# EAGLE board retrostoneA20-1.15 (EAGLE 7.6.0), part 1 of 5
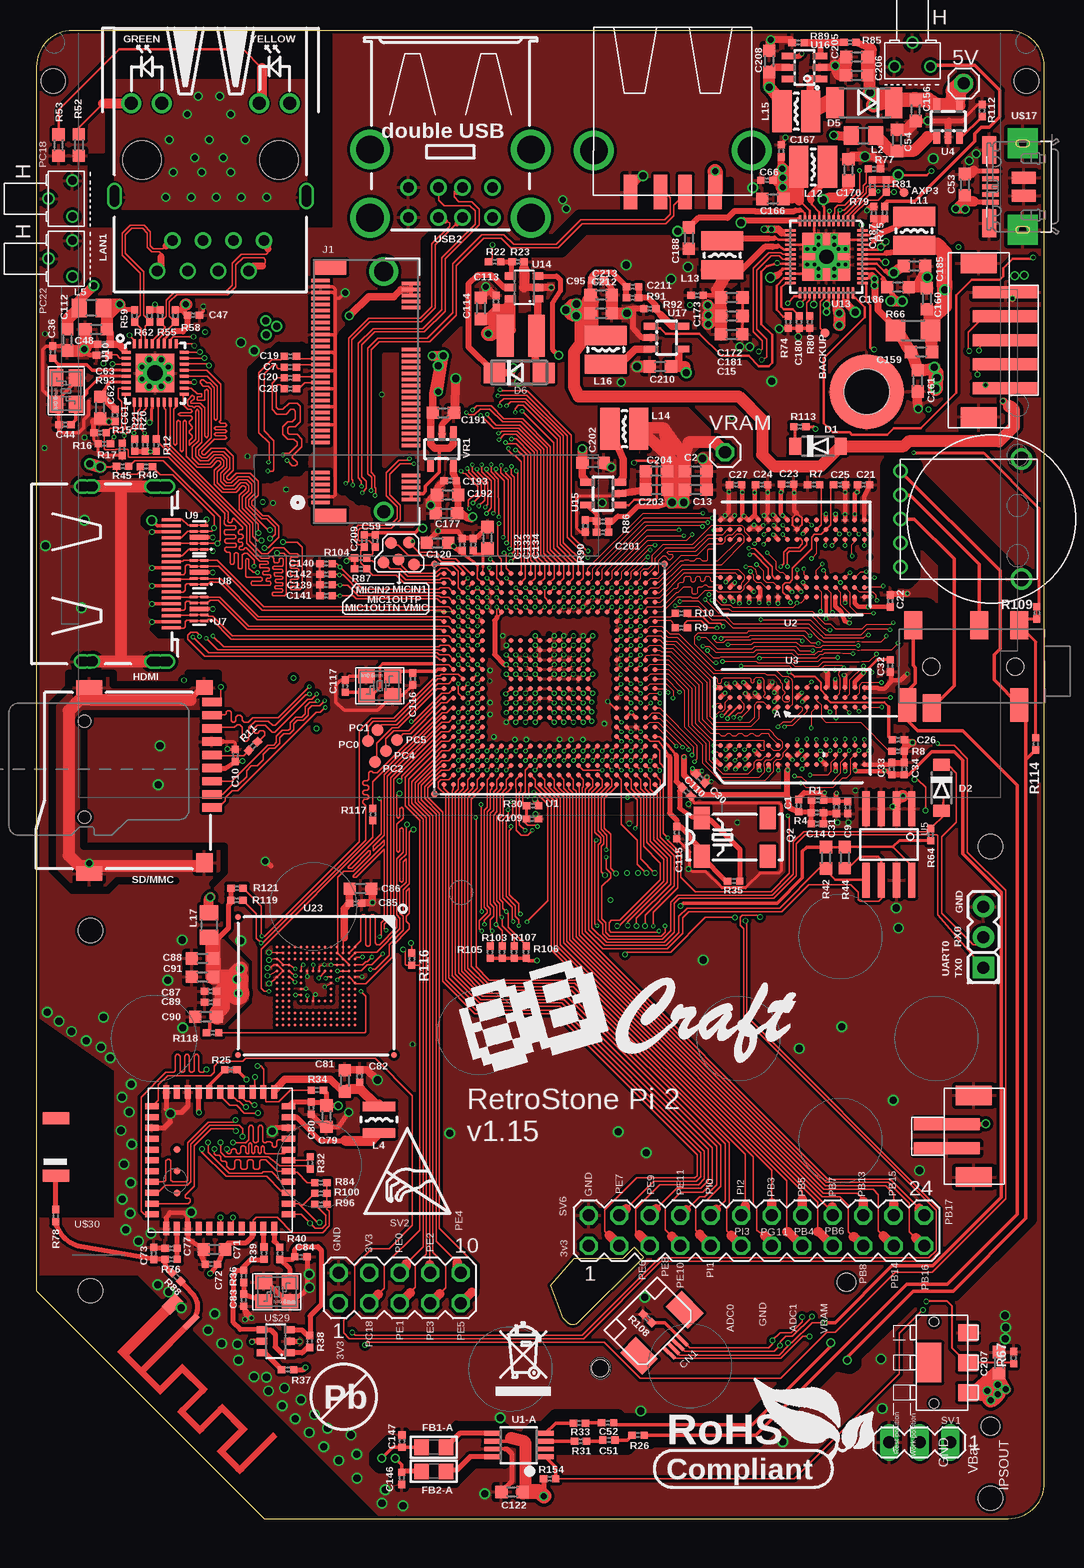
[diagram p5: board, top side]
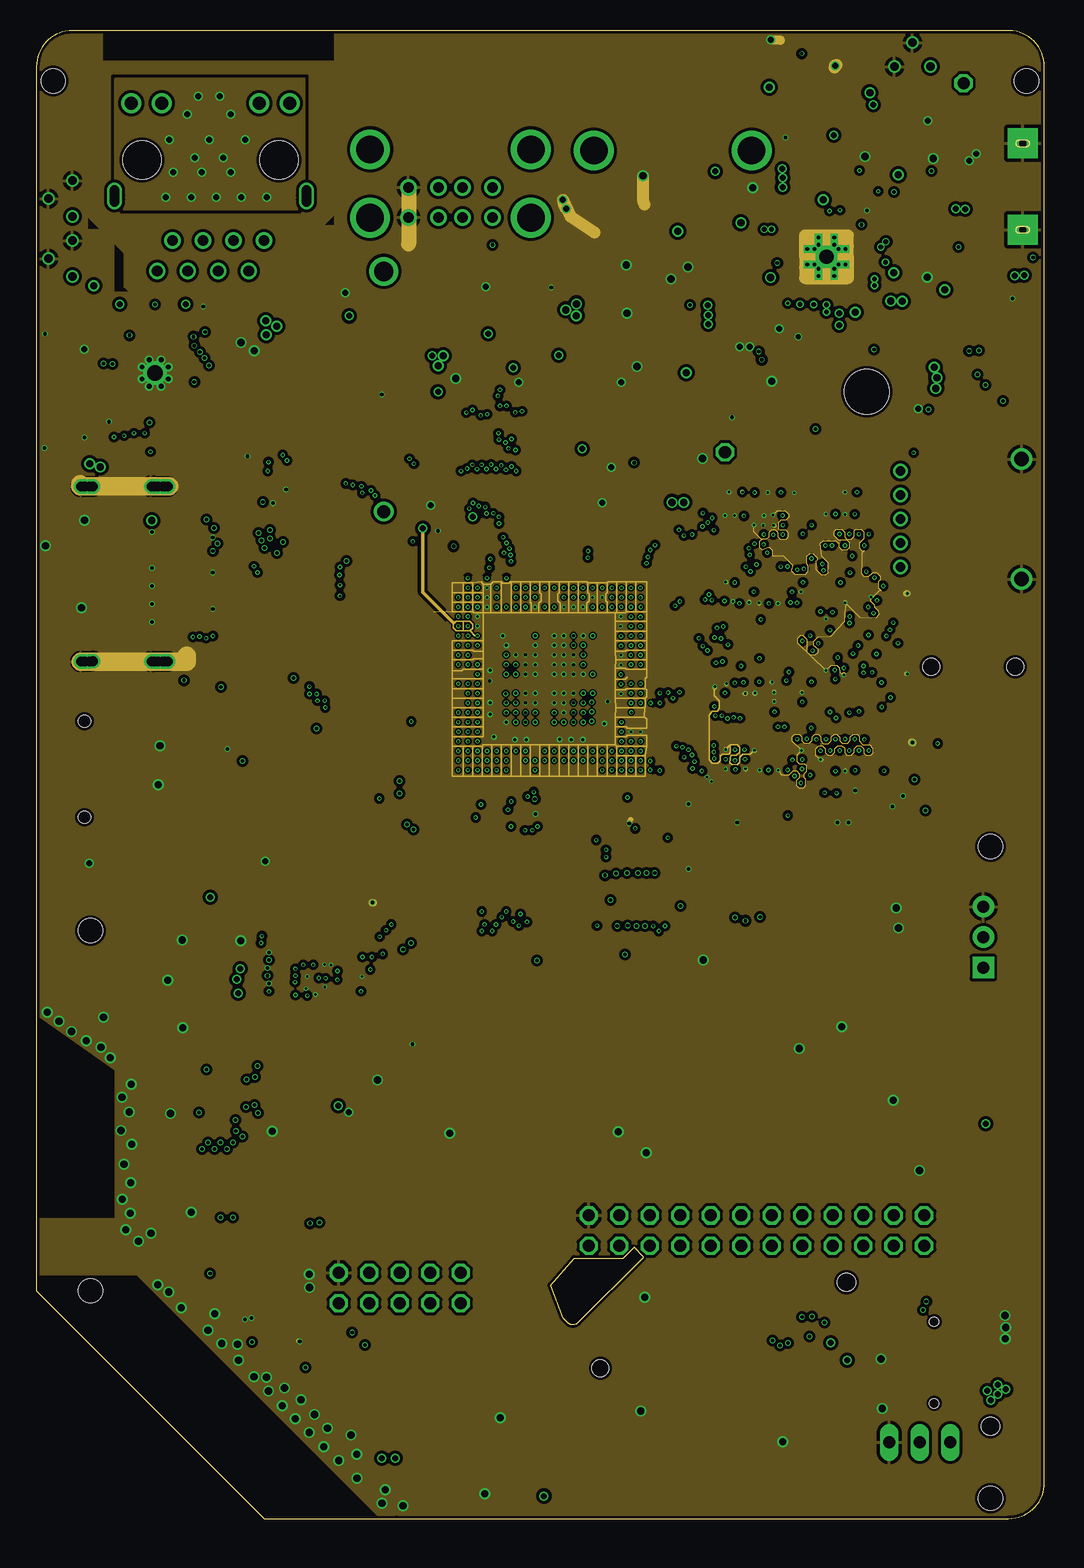
[diagram p6: board, inner layer GND]
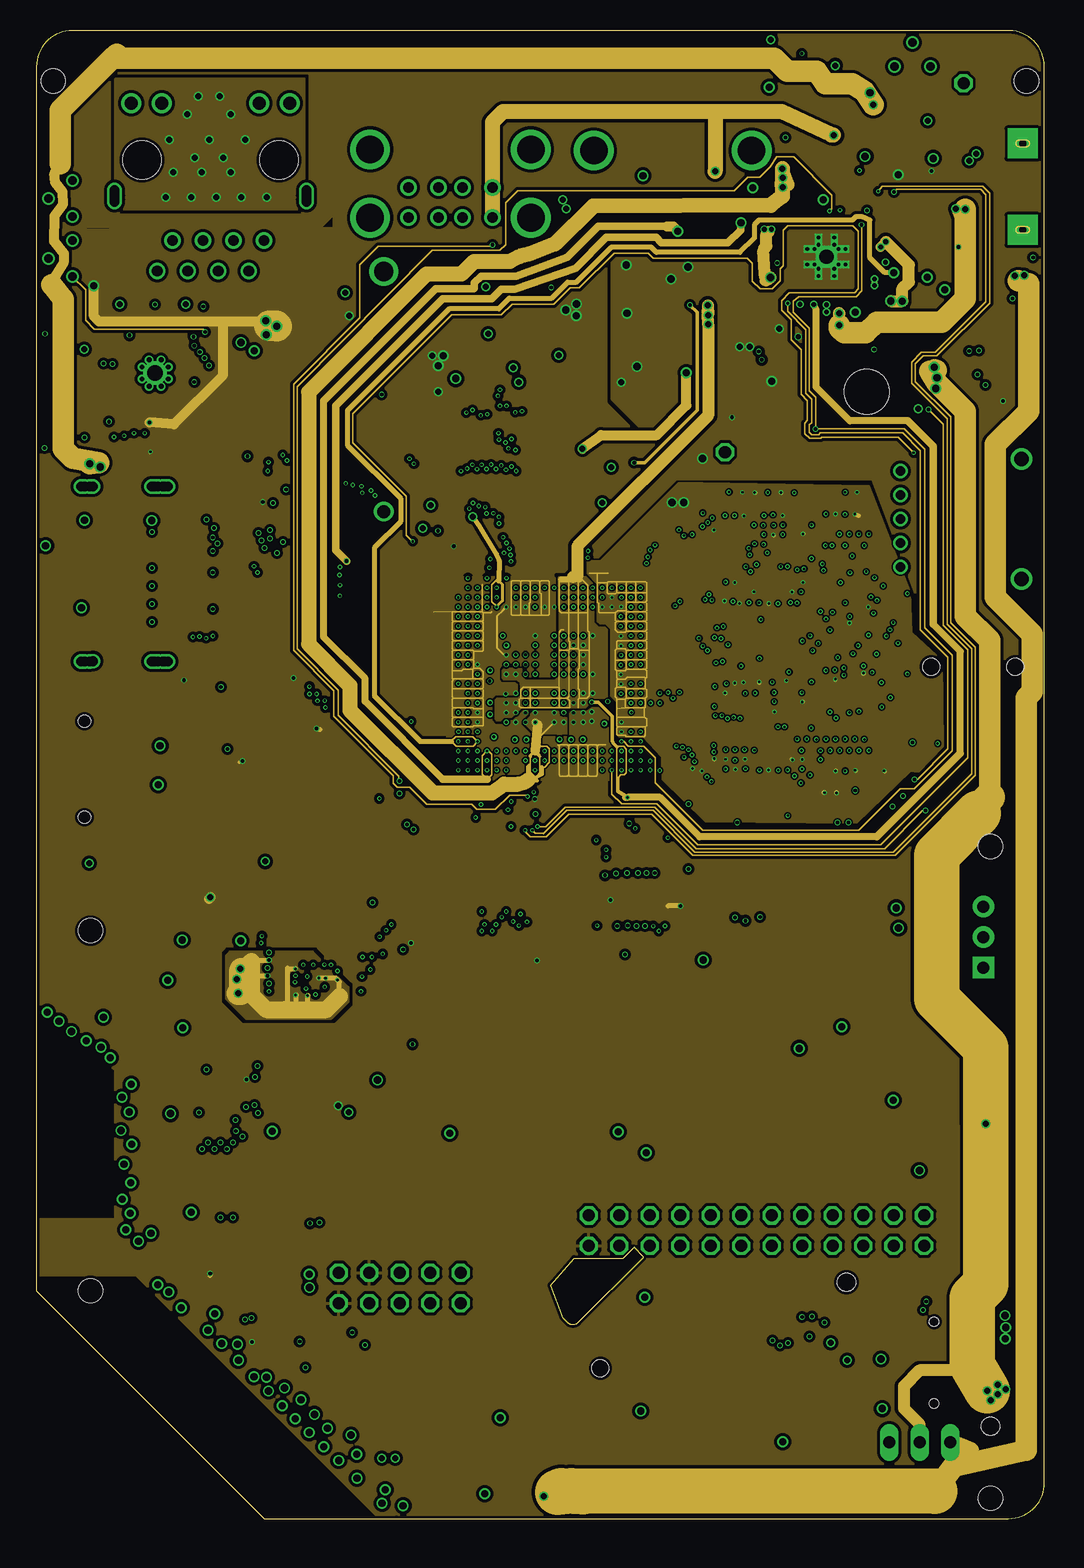
[diagram p7: board, inner layer PWR]
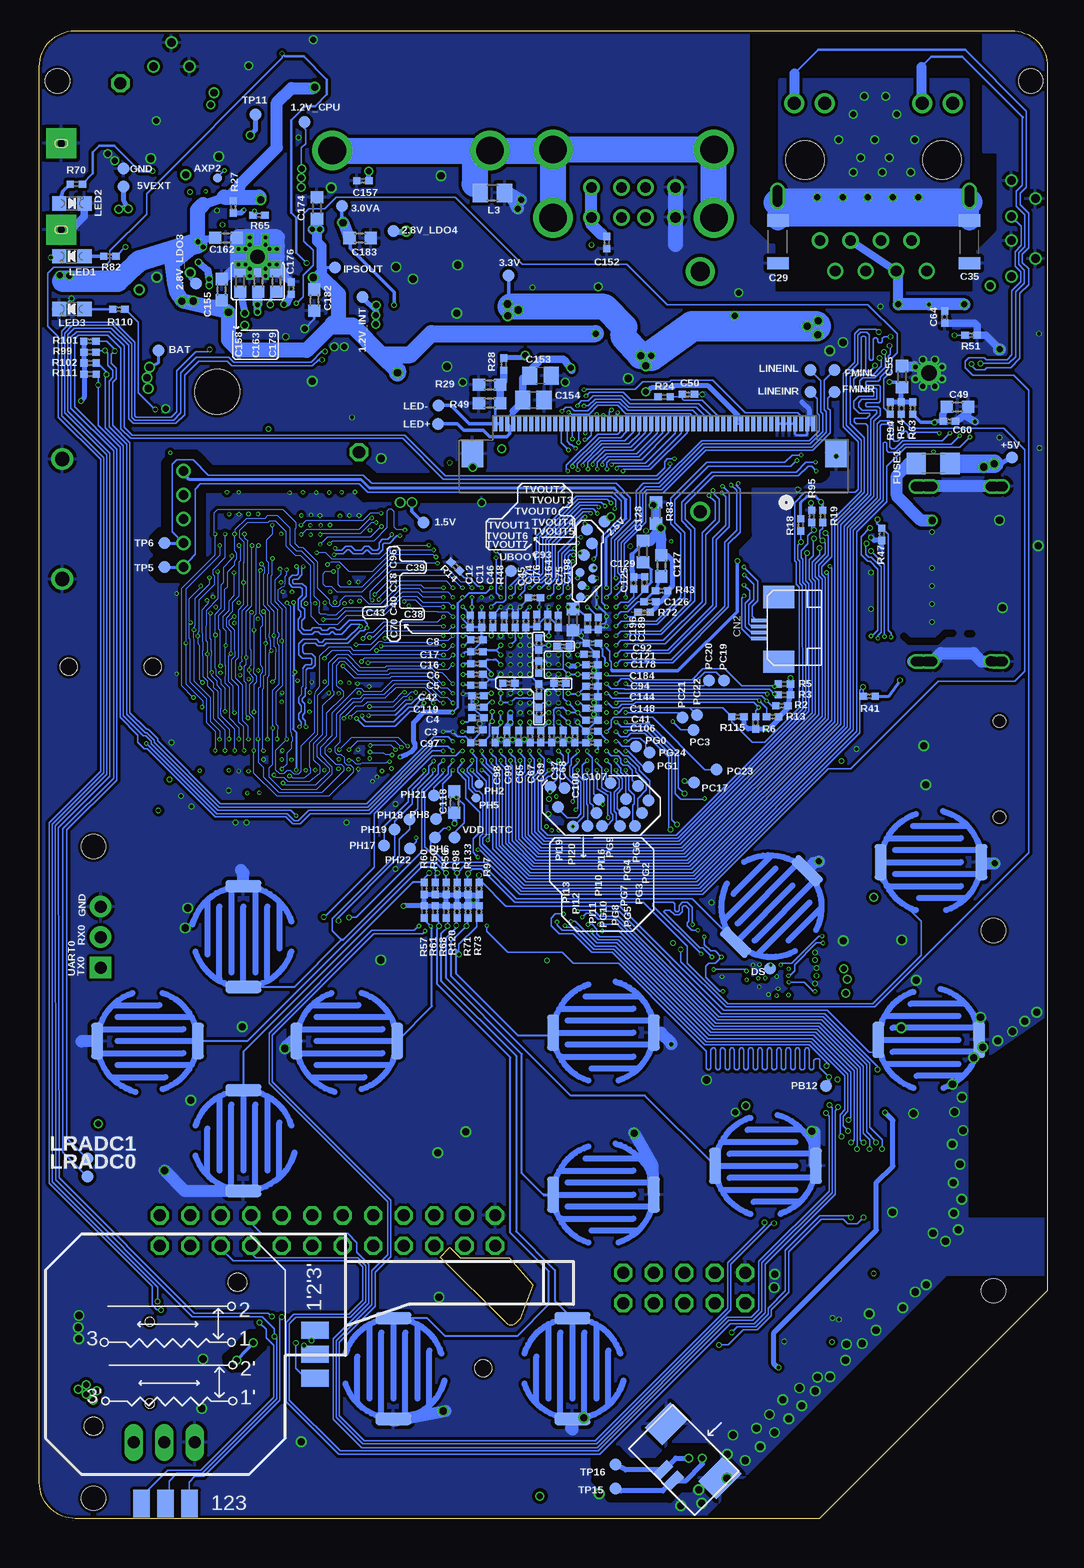
[diagram p8: board, bottom side, seen from below]

Size 84 x 124 mm. Coordinates in mm from the lower left corner, seen from the top.
Outline: 3,124 arc90 0,121 0,28.4 0,19 19,0 30,0 81,0 arc90 84,3 84,121 arc94 80.77,123.99 80.62,123.99 80.37,124 3,124
Outline: 49.8,22.6 48.9,21.7 44.8,21.7 42.85,19.45 43.9,16.7 44.3,16.3 arc90 45.15,16.35 50.6,21.8 49.8,22.6
Copper layers (1+2*15+16): Top 0.035mm / dielectric 0.12mm / GND 0.035mm / dielectric 0.2mm / PWR 0.035mm / dielectric 0.12mm / Bottom 0.035mm
Design rules "default *": minimum track width 4mil, minimum drill 10mil, track to track 5mil, track to pad 5mil, pad to pad 5mil, via to via 5mil, smd to smd 1mil, copper to edge 10mil, drill to drill 8mil, minimum pad ring 6mil, minimum via ring 3mil, stop-mask expansion 4mil, vias tented up to drill 25mil, thermal gap 12mil
Net classes: 2 lan_sh: clearance 0.762 mm
Holes 2 mm at 4.5,49 82.5,119.8 79.5,56 79.5,1.7 1.4,119.8 4.5,19
Holes 1.4 mm at 47,12.52
tKeepout: area 1,45.5 to 8,52.5; area 76,52.5 to 83,59.5; area 79,116.3 to 86,123.3; area 1,15.5 to 8,22.5; area -2.1,116.3 to 4.9,123.3; 8 lines
bKeepout: area 2.4,16.9 to 6.6,21.1; area 77.5,-0.3 to 81.5,3.7; 30 lines
tRestrict: 266 lines
bRestrict: 79 lines

## Footprints (pad centres in the part's own frame; a part is rotated, then mirrored left to right if it is on the bottom)
TESTPAD_40-ROUND = smd 1.016 x 1.016: 1 0,0
1X01 = drill 1.016 octagon: 1 0,0
TESTPAD_30-ROUND = smd 0.762 x 0.762: 1 0,0
C0402_TI = smd 0.61 x 0.584: 1 -0.508,0; 2 0.508,0
C0603_DWS = smd 1.016 x 1.016: 1 -0.889,0; 2 0.889,0
C1206_5MILS_WS_ISO = smd 1.016 x 1.778: 1 -1.778,0; 2 1.778,0
C0805_5MIL = smd 1.27 x 1.524: 1 -0.889,0; 2 0.889,0
FPC_0.5MM-4 = smd 0.3 x 1.25: 1 -0.75,-0.45; 2 -0.25,-0.45; 3 0.25,-0.45; 4 0.75,-0.45 | smd 1.85 x 2.6: MT -2.7,-2.1; MT2 2.7,-2.1
SOD-123 = smd 1 x 1.4: A 1.9,0; C -1.9,0
MELF-MLL41 = smd 1.45 x 2.6: 1 -2.445,0; 2 2.445,0
DO214AC = smd 1.8 x 1.7: A 2.05,0; C -2.05,0
PAD_BUTTON = smd 1 x 3: P$1 -4.2,0; P$2 4.2,0
_0805 = smd 1.2 x 1.3: 1 -1.016,0; 2 1.016,0
1206 = smd 1.6 x 1.8: 1 -1.4,0; 2 1.4,0
HDMI-SWM-19 = smd 0.25 x 1.6: 1 -4.5,-5.55; 2 -4,-5.55; 3 -3.5,-5.55; 4 -3,-5.55; 5 -2.5,-5.55; 6 -2,-5.55; 7 -1.5,-5.55; 8 -1,-5.55; 9 -0.5,-5.55; 10 0,-5.55; 11 0.5,-5.55; 12 1,-5.55; 13 1.5,-5.55; 14 2,-5.55; 15 2.5,-5.55; 16 3,-5.55; 17 3.5,-5.55; 18 4,-5.55; 19 4.5,-5.55 | drill 0.8: P$5 -7.3,-4.85; P$7 -7.3,1.25; P$9 7.3,1.25; P$11 7.3,-4.85; P$13 -7.3,-4.45; P$15 -7.3,1.65; P$18 7.3,1.65; P$20 7.3,-4.45; P$21 -7.3,-4.15; P$22 -7.3,-5; P$23 7.3,-5; P$24 7.3,-4.15; P$25 -7.3,-5.3; P$26 7.3,-5.3; P$27 7.3,0.95; P$28 -7.275,0.95; SH1 -7.3,-3.9; SH2 -7.3,1.95; SH3 7.3,1.95; SH4 7.3,-3.9
CONN67_2199230_LITE = smd 0.305 x 1.549: 1 -18.5,7.55; 2 -18.25,0; 3 -18,7.55; 4 -17.75,0; 5 -17.5,7.55; 6 -17.25,0; 7 -17,7.55; 8 -16.75,0; 9 -16.5,7.55; 10 -16.25,0; 11 -16,7.55; 20 -13.75,0; 21 -13.5,7.55; 22 -13.25,0; 23 -13,7.55; 24 -12.75,0; 25 -12.5,7.55; 26 -12.25,0; 27 -12,7.55; 28 -11.75,0; 29 -11.5,7.55; 30 -11.25,0; 31 -11,7.55; 32 -10.75,0; 33 -10.5,7.55; 34 -10.25,0; 35 -10,7.55; 36 -9.75,0; 37 -9.5,7.55; 38 -9.25,0; 39 -9,7.55; 40 -8.75,0; 41 -8.5,7.55; 42 -8.25,0; 43 -8,7.55; 44 -7.75,0; 45 -7.5,7.55; 46 -7.25,0; 47 -7,7.55; 48 -6.75,0; 49 -6.5,7.55; 50 -6.25,0; 51 -6,7.55; 52 -5.75,0; 53 -5.5,7.55; 55 -5,7.55; 57 -4.5,7.55; 59 -4,7.55; 61 -3.5,7.55; 63 -3,7.55; 65 -2.5,7.55; 66 -2.25,0; 67 -2,7.55; 68 -1.75,0; 69 -1.5,7.55; 70 -1.25,0; 71 -1,7.55; 72 -0.75,0; 73 -0.5,7.55; 74 -0.25,0; 75 0,7.55 | smd 1.194 x 2.743: 76 -19.6,6.775; 77 1.1,6.775 | drill 1.092 pad 1.092: 78 -19.253,2.286 | drill 1.6 pad 1.6: 79 0.762,2.286
CD32_INDUCTOR = smd 3.5 x 1.4: P$1 0,-1.3; P$2 0,1.3
L0805_5MIL_DWS = smd 1.27 x 1.524: 1 -1.016,0; 2 1.016,0
CD25 = smd 0.8 x 2.7: 1 -1.1,0; 2 1.1,0
CD32 = smd 1.6 x 3.5: 1 -1.2,0; 2 1.2,0
RJLBC-060TC1_MILLING = drill 0.9: 1 -4.455,6.7; 2 -3.185,9.24; 3 -1.915,6.7; 4 -0.645,9.24; 5 0.625,6.7; 6 1.895,9.24; 7 3.165,6.7; 8 4.435,9.24 | drill 0.8: _1 -8,2.5; _2 -8,2.7; _3 -8,2.9; _4 -8,3.3; _5 -8,3.5; _6 8,3.5; _7 8,3.3; _8 8,2.9; _9 8,2.7; _10 8,2.5; GND1 -8,3.1; GND2 8,3.1 | drill 1.1: AG 4.07,-4.748; AY -6.61,-4.748; KG 6.61,-4.748; KY -4.07,-4.748 | hole 3.2: -5.715,0; 5.715,0
CHIPLED_0805_NOOUTLINE = smd 1.2 x 1.2: A 0,-1.05; C 0,1.05
MC-306 = smd 1.3 x 1.9: 1 -2.75,-1.6; 2 2.75,-1.6; 3 2.75,1.6; 4 -2.75,1.6
R0402_TI = smd 0.61 x 0.584: 1 -0.508,0; 2 0.508,0
R0402_TI_0R = smd 0.61 x 0.584: 1 -0.508,0; 2 0.508,0
R0603_5MIL_DWS = smd 1.016 x 1.016: 1 -0.889,0; 2 0.889,0
R1206_5MIL_WS = smd 1.651 x 1.778: 1 -1.46,0; 2 1.46,0
0603_0R = smd 1.016 x 1.016: 1 -0.889,0; 2 0.889,0
TFC-WPAPR-08 = smd 1.6 x 0.7: 1 -7.375,2.25; 2 -7.375,1.15; 3 -7.375,0.05; 4 -7.375,-1.05; 5 -7.375,-2.15; 6 -7.375,-3.25; 7 -7.375,-4.35; 8 -7.375,-5.45; 9 -7.375,-6.55 | smd 1.4 x 1.2: 10 -6.75,-7.75 | smd 1.4 x 1.6: 11 -6.75,6.85 | smd 2.2 x 1.2: 12 2.85,-7.75; 13 2.85,7.75 | hole 1: 3.25,-4.95; 3.25,3.05
MA03-1 = drill 1.016 long: 1 -2.54,0; 2 0,0; 3 2.54,0
MA05-2 = drill 1.016 octagon: 1 -5.08,-1.27; 2 -5.08,1.27; 3 -2.54,-1.27; 4 -2.54,1.27; 5 0,-1.27; 6 0,1.27; 7 2.54,-1.27; 8 2.54,1.27; 9 5.08,-1.27; 10 5.08,1.27
MA12-2 = drill 1.016 octagon: 1 -13.97,-1.27; 2 -13.97,1.27; 3 -11.43,-1.27; 4 -11.43,1.27; 5 -8.89,-1.27; 6 -8.89,1.27; 7 -6.35,-1.27; 8 -6.35,1.27; 9 -3.81,-1.27; 10 -3.81,1.27; 11 -1.27,-1.27; 12 -1.27,1.27; 13 1.27,-1.27; 14 1.27,1.27; 15 3.81,-1.27; 16 3.81,1.27; 17 6.35,-1.27; 18 6.35,1.27; 19 8.89,-1.27; 20 8.89,1.27; 21 11.43,-1.27; 22 11.43,1.27; 23 13.97,-1.27; 24 13.97,1.27
TFBGA441 = smd 0.4 x 0.4: A1 -8.8,-8.8; A2 -8.8,-8; A3 -8.8,-7.2; A4 -8.8,-6.4; A5 -8.8,-5.6; A6 -8.8,-4.8; A7 -8.8,-4; A8 -8.8,-3.2; A9 -8.8,-2.4; A10 -8.8,-1.6; A11 -8.8,-0.8; A12 -8.8,0; A13 -8.8,0.8; A14 -8.8,1.6; A15 -8.8,2.4; A16 -8.8,3.2; A17 -8.8,4; A18 -8.8,4.8; A19 -8.8,5.6; A20 -8.8,6.4; A21 -8.8,7.2; A22 -8.8,8; A23 -8.8,8.8; AA1 7.2,-8.8; AA2 7.2,-8; AA3 7.2,-7.2; AA4 7.2,-6.4; AA5 7.2,-5.6; AA6 7.2,-4.8; AA7 7.2,-4; AA8 7.2,-3.2; AA9 7.2,-2.4; AA10 7.2,-1.6; AA11 7.2,-0.8; AA12 7.2,0; AA13 7.2,0.8; AA14 7.2,1.6; AA15 7.2,2.4; AA16 7.2,3.2; AA17 7.2,4; AA18 7.2,4.8; AA19 7.2,5.6; AA20 7.2,6.4; AA21 7.2,7.2; AA22 7.2,8; AA23 7.2,8.8; AB1 8,-8.8; AB2 8,-8; AB3 8,-7.2; AB4 8,-6.4; AB5 8,-5.6; AB6 8,-4.8; AB7 8,-4; AB8 8,-3.2; AB9 8,-2.4; AB10 8,-1.6; AB11 8,-0.8; AB12 8,0; AB13 8,0.8; AB14 8,1.6; AB15 8,2.4; AB16 8,3.2; AB17 8,4; AB18 8,4.8; AB19 8,5.6; AB20 8,6.4; AB21 8,7.2; AB22 8,8; AB23 8,8.8; AC1 8.8,-8.8; AC2 8.8,-8; AC3 8.8,-7.2; AC4 8.8,-6.4; AC5 8.8,-5.6; AC6 8.8,-4.8; AC7 8.8,-4; AC8 8.8,-3.2; AC9 8.8,-2.4; AC10 8.8,-1.6; AC11 8.8,-0.8; AC12 8.8,0; AC13 8.8,0.8; AC14 8.8,1.6; AC15 8.8,2.4; AC16 8.8,3.2; AC17 8.8,4; AC18 8.8,4.8; AC19 8.8,5.6; AC20 8.8,6.4; AC21 8.8,7.2; AC22 8.8,8; AC23 8.8,8.8; B1 -8,-8.8; B2 -8,-8; B3 -8,-7.2; B4 -8,-6.4; B5 -8,-5.6; B6 -8,-4.8; B7 -8,-4; B8 -8,-3.2; B9 -8,-2.4; B10 -8,-1.6; B11 -8,-0.8; B12 -8,0; B13 -8,0.8; B14 -8,1.6; B15 -8,2.4; B16 -8,3.2; B17 -8,4; B18 -8,4.8; B19 -8,5.6; B20 -8,6.4; B21 -8,7.2; B22 -8,8; B23 -8,8.8; C1 -7.2,-8.8; C2 -7.2,-8; C3 -7.2,-7.2; C4 -7.2,-6.4; C5 -7.2,-5.6; C6 -7.2,-4.8; C7 -7.2,-4; C8 -7.2,-3.2; C9 -7.2,-2.4; C10 -7.2,-1.6; C11 -7.2,-0.8; C12 -7.2,0; C13 -7.2,0.8; C14 -7.2,1.6; C15 -7.2,2.4; C16 -7.2,3.2; C17 -7.2,4; C18 -7.2,4.8; C19 -7.2,5.6; C20 -7.2,6.4; C21 -7.2,7.2; C22 -7.2,8; C23 -7.2,8.8; D1 -6.4,-8.8; D2 -6.4,-8; D3 -6.4,-7.2; D4 -6.4,-6.4; D5 -6.4,-5.6; D6 -6.4,-4.8; D7 -6.4,-4; D8 -6.4,-3.2; D9 -6.4,-2.4; D10 -6.4,-1.6; D11 -6.4,-0.8; D12 -6.4,0; D13 -6.4,0.8; D14 -6.4,1.6; D15 -6.4,2.4; D16 -6.4,3.2; D17 -6.4,4; D18 -6.4,4.8; D19 -6.4,5.6; D20 -6.4,6.4; D21 -6.4,7.2; D22 -6.4,8; D23 -6.4,8.8; E1 -5.6,-8.8; E2 -5.6,-8; E3 -5.6,-7.2; E4 -5.6,-6.4; E5 -5.6,-5.6; E6 -5.6,-4.8; E7 -5.6,-4; E8 -5.6,-3.2; E9 -5.6,-2.4; E10 -5.6,-1.6; E11 -5.6,-0.8; E12 -5.6,0; E13 -5.6,0.8; E14 -5.6,1.6; E15 -5.6,2.4; E16 -5.6,3.2; E17 -5.6,4; E18 -5.6,4.8; E19 -5.6,5.6; E20 -5.6,6.4; E21 -5.6,7.2; E22 -5.6,8; E23 -5.6,8.8; F1 -4.8,-8.8; F2 -4.8,-8; F3 -4.8,-7.2; F4 -4.8,-6.4; F5 -4.8,-5.6; F19 -4.8,5.6; F20 -4.8,6.4; F21 -4.8,7.2; F22 -4.8,8; F23 -4.8,8.8; G1 -4,-8.8; G2 -4,-8; G3 -4,-7.2; G4 -4,-6.4; G5 -4,-5.6; G19 -4,5.6; G20 -4,6.4; G21 -4,7.2; G22 -4,8; G23 -4,8.8; H1 -3.2,-8.8; H2 -3.2,-8; H3 -3.2,-7.2; H4 -3.2,-6.4; H5 -3.2,-5.6; H8 -3.2,-3.2; H9 -3.2,-2.4; H10 -3.2,-1.6; H11 -3.2,-0.8; H12 -3.2,0; H13 -3.2,0.8; H14 -3.2,1.6; H15 -3.2,2.4; H16 -3.2,3.2; H19 -3.2,5.6; H20 -3.2,6.4; H21 -3.2,7.2; H22 -3.2,8; H23 -3.2,8.8; J1 -2.4,-8.8; J2 -2.4,-8; J3 -2.4,-7.2; J4 -2.4,-6.4; J5 -2.4,-5.6; J8 -2.4,-3.2; J9 -2.4,-2.4; J10 -2.4,-1.6; J11 -2.4,-0.8; J12 -2.4,0; J13 -2.4,0.8; J14 -2.4,1.6; J15 -2.4,2.4; J16 -2.4,3.2; J19 -2.4,5.6; J20 -2.4,6.4; J21 -2.4,7.2; J22 -2.4,8; J23 -2.4,8.8; K1 -1.6,-8.8; K2 -1.6,-8; K3 -1.6,-7.2; K4 -1.6,-6.4; K5 -1.6,-5.6; K8 -1.6,-3.2; K9 -1.6,-2.4; K10 -1.6,-1.6; K11 -1.6,-0.8; K12 -1.6,0; K13 -1.6,0.8; K14 -1.6,1.6; K15 -1.6,2.4; K16 -1.6,3.2; K19 -1.6,5.6; K20 -1.6,6.4; K21 -1.6,7.2; K22 -1.6,8; K23 -1.6,8.8; L1 -0.8,-8.8; L2 -0.8,-8; L3 -0.8,-7.2; L4 -0.8,-6.4; L5 -0.8,-5.6; L8 -0.8,-3.2; L9 -0.8,-2.4; L10 -0.8,-1.6; L11 -0.8,-0.8; L12 -0.8,0; L13 -0.8,0.8; L14 -0.8,1.6; L15 -0.8,2.4; L16 -0.8,3.2; L19 -0.8,5.6; L20 -0.8,6.4; L21 -0.8,7.2; L22 -0.8,8; L23 -0.8,8.8; M1 0,-8.8; M2 0,-8; M3 0,-7.2; M4 0,-6.4; M5 0,-5.6; M8 0,-3.2; M9 0,-2.4; M10 0,-1.6; M11 0,-0.8; M12 0,0; M13 0,0.8; M14 0,1.6; M15 0,2.4; M16 0,3.2; M19 0,5.6; M20 0,6.4; M21 0,7.2; M22 0,8; M23 0,8.8; N1 0.8,-8.8; N2 0.8,-8; N3 0.8,-7.2; N4 0.8,-6.4; N5 0.8,-5.6; N8 0.8,-3.2; N9 0.8,-2.4; N10 0.8,-1.6; N11 0.8,-0.8; N12 0.8,0; N13 0.8,0.8; N14 0.8,1.6; N15 0.8,2.4; N16 0.8,3.2; N19 0.8,5.6; N20 0.8,6.4; N21 0.8,7.2; N22 0.8,8; N23 0.8,8.8; P1 1.6,-8.8; P2 1.6,-8; P3 1.6,-7.2; P4 1.6,-6.4; P5 1.6,-5.6; P8 1.6,-3.2; P9 1.6,-2.4; P10 1.6,-1.6; P11 1.6,-0.8; P12 1.6,0; P13 1.6,0.8; P14 1.6,1.6; P15 1.6,2.4; P16 1.6,3.2; P19 1.6,5.6; P20 1.6,6.4; P21 1.6,7.2; P22 1.6,8; P23 1.6,8.8; R1 2.4,-8.8; R2 2.4,-8; R3 2.4,-7.2; R4 2.4,-6.4; R5 2.4,-5.6; R8 2.4,-3.2; R9 2.4,-2.4; R10 2.4,-1.6; R11 2.4,-0.8; R12 2.4,0; R13 2.4,0.8; R14 2.4,1.6; R15 2.4,2.4; R16 2.4,3.2; R19 2.4,5.6; R20 2.4,6.4; R21 2.4,7.2; R22 2.4,8; R23 2.4,8.8; T1 3.2,-8.8; T2 3.2,-8; T3 3.2,-7.2; T4 3.2,-6.4; T5 3.2,-5.6; T8 3.2,-3.2; T9 3.2,-2.4; T10 3.2,-1.6; T11 3.2,-0.8; T12 3.2,0; T13 3.2,0.8; T14 3.2,1.6; T15 3.2,2.4; T16 3.2,3.2; T19 3.2,5.6; T20 3.2,6.4; T21 3.2,7.2; T22 3.2,8; T23 3.2,8.8; U1 4,-8.8; U2 4,-8; U3 4,-7.2; U4 4,-6.4; U5 4,-5.6; U19 4,5.6; U20 4,6.4; U21 4,7.2; U22 4,8; U23 4,8.8; V1 4.8,-8.8; V2 4.8,-8; V3 4.8,-7.2; V4 4.8,-6.4; V5 4.8,-5.6; V19 4.8,5.6; V20 4.8,6.4; V21 4.8,7.2; V22 4.8,8; V23 4.8,8.8; W1 5.6,-8.8; W2 5.6,-8; W3 5.6,-7.2; W4 5.6,-6.4; W5 5.6,-5.6; W6 5.6,-4.8; W7 5.6,-4; W8 5.6,-3.2; W9 5.6,-2.4; W10 5.6,-1.6; W11 5.6,-0.8; W12 5.6,0; W13 5.6,0.8; W14 5.6,1.6; W15 5.6,2.4; W16 5.6,3.2; W17 5.6,4; W18 5.6,4.8; W19 5.6,5.6; W20 5.6,6.4; W21 5.6,7.2; W22 5.6,8; W23 5.6,8.8; Y1 6.4,-8.8; Y2 6.4,-8; Y3 6.4,-7.2; Y4 6.4,-6.4; Y5 6.4,-5.6; Y6 6.4,-4.8; Y7 6.4,-4; Y8 6.4,-3.2; Y9 6.4,-2.4; Y10 6.4,-1.6; Y11 6.4,-0.8; Y12 6.4,0; Y13 6.4,0.8; Y14 6.4,1.6; Y15 6.4,2.4; Y16 6.4,3.2; Y17 6.4,4; Y18 6.4,4.8; Y19 6.4,5.6; Y20 6.4,6.4; Y21 6.4,7.2; Y22 6.4,8; Y23 6.4,8.8 | smd 0.6 x 0.6: FID1 -9.6,9.6; FID2 9.6,9.6; FID3 9.6,-9.6
MSOP8_0.65MM = smd 0.4 x 1.4: 1 -0.975,-2.2; 2 -0.325,-2.2; 3 0.325,-2.2; 4 0.975,-2.2; 5 0.975,2.2; 6 0.325,2.2; 7 -0.325,2.2; 8 -0.975,2.2
FBGA96_SK = smd 0.4 x 0.4: A1 -6,-3.2; A2 -6,-2.4; A3 -6,-1.6; A7 -6,1.6; A8 -6,2.4; A9 -6,3.2; B1 -5.2,-3.2; B2 -5.2,-2.4; B3 -5.2,-1.6; B7 -5.2,1.6; B8 -5.2,2.4; B9 -5.2,3.2; C1 -4.4,-3.2; C2 -4.4,-2.4; C3 -4.4,-1.6; C7 -4.4,1.6; C8 -4.4,2.4; C9 -4.4,3.2; D1 -3.6,-3.2; D2 -3.6,-2.4; D3 -3.6,-1.6; D7 -3.6,1.6; D8 -3.6,2.4; D9 -3.6,3.2; E1 -2.8,-3.2; E2 -2.8,-2.4; E3 -2.8,-1.6; E7 -2.8,1.6; E8 -2.8,2.4; E9 -2.8,3.2; F1 -2,-3.2; F2 -2,-2.4; F3 -2,-1.6; F7 -2,1.6; F8 -2,2.4; F9 -2,3.2; G1 -1.2,-3.2; G2 -1.2,-2.4; G3 -1.2,-1.6; G7 -1.2,1.6; G8 -1.2,2.4; G9 -1.2,3.2; H1 -0.4,-3.2; H2 -0.4,-2.4; H3 -0.4,-1.6; H7 -0.4,1.6; H8 -0.4,2.4; H9 -0.4,3.2; J1 0.4,-3.2; J2 0.4,-2.4; J3 0.4,-1.6; J7 0.4,1.6; J8 0.4,2.4; J9 0.4,3.2; K1 1.2,-3.2; K2 1.2,-2.4; K3 1.2,-1.6; K7 1.2,1.6; K8 1.2,2.4; K9 1.2,3.2; L1 2,-3.2; L2 2,-2.4; L3 2,-1.6; L7 2,1.6; L8 2,2.4; L9 2,3.2; M1 2.8,-3.2; M2 2.8,-2.4; M3 2.8,-1.6; M7 2.8,1.6; M8 2.8,2.4; M9 2.8,3.2; N1 3.6,-3.2; N2 3.6,-2.4; N3 3.6,-1.6; N7 3.6,1.6; N8 3.6,2.4; N9 3.6,3.2; P1 4.4,-3.2; P2 4.4,-2.4; P3 4.4,-1.6; P7 4.4,1.6; P8 4.4,2.4; P9 4.4,3.2; R1 5.2,-3.2; R2 5.2,-2.4; R3 5.2,-1.6; R7 5.2,1.6; R8 5.2,2.4; R9 5.2,3.2; T1 6,-3.2; T2 6,-2.4; T3 6,-1.6; T7 6,1.6; T8 6,2.4; T9 6,3.2
SOT23-5 = smd 1.2 x 0.55: 1 1.3,-0.95; 2 1.3,0; 3 1.3,0.95; 4 -1.3,0.95; 5 -1.3,-0.95
SO-08MN = smd 0.61 x 2.921: 1 -1.905,-2.981; 2 -0.635,-2.981; 3 0.635,-2.981; 4 1.905,-2.981; 5 1.905,2.981; 6 0.635,2.981; 7 -0.635,2.981; 8 -1.905,2.981
SLP2510P8 = smd 0.2 x 0.675: 1 -1,-0.438; 2 -0.5,-0.438; 4 0.5,-0.438; 5 1,-0.438; 6 1,0.438; 7 0.5,0.438; 9 -0.5,0.438; 10 -1,0.438 | smd 0.4 x 0.775: 3 0,-0.388; 8 0,0.388
QFN-32(DRILLS) = smd 0.25 x 0.75: 1 -1.75,-2.425; 2 -1.25,-2.425; 3 -0.75,-2.425; 4 -0.25,-2.425; 5 0.25,-2.425; 6 0.75,-2.425; 7 1.25,-2.425; 8 1.75,-2.425; 17 1.75,2.425; 18 1.25,2.425; 19 0.75,2.425; 20 0.25,2.425; 21 -0.25,2.425; 22 -0.75,2.425; 23 -1.25,2.425; 24 -1.75,2.425 | smd 0.75 x 0.25: 9 2.425,-1.75; 10 2.425,-1.25; 11 2.425,-0.75; 12 2.425,-0.25; 13 2.425,0.25; 14 2.425,0.75; 15 2.425,1.25; 16 2.425,1.75; 25 -2.425,1.75; 26 -2.425,1.25; 27 -2.425,0.75; 28 -2.425,0.25; 29 -2.425,-0.25; 30 -2.425,-0.75; 31 -2.425,-1.25; 32 -2.425,-1.75 | drill 1.3: EP1 0,0 | drill 0.4: EP2 -0.5,1.1; EP3 0.5,1.1; EP4 1.1,0.5; EP5 1.1,-0.5; EP6 0.5,-1.1; EP7 -0.5,-1.1; EP8 -1.1,-0.5; EP9 -1.1,0.5 | smd 3.2 x 3.2: EXP_PAD 0,0
QFN48 = smd 0.2 x 0.9: 1 -2.2,-3; 2 -1.8,-3; 3 -1.4,-3; 4 -1,-3; 5 -0.6,-3; 6 -0.2,-3; 7 0.2,-3; 8 0.6,-3; 9 1,-3; 10 1.4,-3; 11 1.8,-3; 12 2.2,-3; 25 2.2,3; 26 1.8,3; 27 1.4,3; 28 1,3; 29 0.6,3; 30 0.2,3; 31 -0.2,3; 32 -0.6,3; 33 -1,3; 34 -1.4,3; 35 -1.8,3; 36 -2.2,3 | smd 0.9 x 0.2: 13 3,-2.2; 14 3,-1.8; 15 3,-1.4; 16 3,-1; 17 3,-0.6; 18 3,-0.2; 19 3,0.2; 20 3,0.6; 21 3,1; 22 3,1.4; 23 3,1.8; 24 3,2.2; 37 -3,2.2; 38 -3,1.8; 39 -3,1.4; 40 -3,1; 41 -3,0.6; 42 -3,0.2; 43 -3,-0.2; 44 -3,-0.6; 45 -3,-1; 46 -3,-1.4; 47 -3,-1.8; 48 -3,-2.2 | drill 1.2 pad 1.422 square: N1 0,0 | drill 0.3 pad 0.4 square: N2 -1.6,0.65; N3 -1,0.65; N4 -1.6,-0.65; N5 -1,-0.65; N6 -0.65,-1.6; N7 -0.65,-1; N8 0.65,-1.6; N9 0.65,-1; N10 1.6,-0.65; N11 1,-0.65; N12 1.6,0.65; N13 1,0.65; N14 0.65,1.6; N15 0.65,1; N16 -0.65,1.6; N17 -0.65,1 | smd 4 x 4: VSS 0,0
SOT23-6 = smd 0.6 x 0.9: 1 -0.95,-1.15; 2 0,-1.15; 3 0.95,-1.15; 4 0.95,1.15; 5 0,1.15; 6 -0.95,1.15
SOT23-6' = smd 1.2 x 0.55: 1 1.3,-0.95; 2 1.3,0; 3 1.3,0.95; 4 -1.3,0.95; 5 -1.3,0; 6 -1.3,-0.95
FBGA153 = smd 0.25 x 0.25: A1 -3.25,-3.25; A2 -3.25,-2.75; A3 -3.25,-2.25; A4 -3.25,-1.75; A5 -3.25,-1.25; A6 -3.25,-0.75; A7 -3.25,-0.25; A8 -3.25,0.25; A9 -3.25,0.75; A10 -3.25,1.25; A11 -3.25,1.75; A12 -3.25,2.25; A13 -3.25,2.75; A14 -3.25,3.25; B1 -2.75,-3.25; B2 -2.75,-2.75; B3 -2.75,-2.25; B4 -2.75,-1.75; B5 -2.75,-1.25; B6 -2.75,-0.75; B7 -2.75,-0.25; B8 -2.75,0.25; B9 -2.75,0.75; B10 -2.75,1.25; B11 -2.75,1.75; B12 -2.75,2.25; B13 -2.75,2.75; B14 -2.75,3.25; C1 -2.25,-3.25; C2 -2.25,-2.75; C3 -2.25,-2.25; C4 -2.25,-1.75; C5 -2.25,-1.25; C6 -2.25,-0.75; C7 -2.25,-0.25; C8 -2.25,0.25; C9 -2.25,0.75; C10 -2.25,1.25; C11 -2.25,1.75; C12 -2.25,2.25; C13 -2.25,2.75; C14 -2.25,3.25; D1 -1.75,-3.25; D2 -1.75,-2.75; D3 -1.75,-2.25; D4 -1.75,-1.75; D12 -1.75,2.25; D13 -1.75,2.75; D14 -1.75,3.25; E1 -1.25,-3.25; E2 -1.25,-2.75; E3 -1.25,-2.25; E5 -1.25,-1.25; E6 -1.25,-0.75; E7 -1.25,-0.25; E8 -1.25,0.25; E9 -1.25,0.75; E10 -1.25,1.25; E12 -1.25,2.25; E13 -1.25,2.75; E14 -1.25,3.25; F1 -0.75,-3.25; F2 -0.75,-2.75; F3 -0.75,-2.25; F5 -0.75,-1.25; F10 -0.75,1.25; F12 -0.75,2.25; F13 -0.75,2.75; F14 -0.75,3.25; G1 -0.25,-3.25; G2 -0.25,-2.75; G3 -0.25,-2.25; G5 -0.25,-1.25; G10 -0.25,1.25; G12 -0.25,2.25; G13 -0.25,2.75; G14 -0.25,3.25; H1 0.25,-3.25; H2 0.25,-2.75; H3 0.25,-2.25; H5 0.25,-1.25; H10 0.25,1.25; H12 0.25,2.25; H13 0.25,2.75; H14 0.25,3.25; J1 0.75,-3.25; J2 0.75,-2.75; J3 0.75,-2.25; J5 0.75,-1.25; J10 0.75,1.25; J12 0.75,2.25; J13 0.75,2.75; J14 0.75,3.25; K1 1.25,-3.25; K2 1.25,-2.75; K3 1.25,-2.25; K5 1.25,-1.25; K6 1.25,-0.75; K7 1.25,-0.25; K8 1.25,0.25; K9 1.25,0.75; K10 1.25,1.25; K12 1.25,2.25; K13 1.25,2.75; K14 1.25,3.25; L1 1.75,-3.25; L2 1.75,-2.75; L3 1.75,-2.25; L12 1.75,2.25; L13 1.75,2.75; L14 1.75,3.25; M1 2.25,-3.25; M2 2.25,-2.75; M3 2.25,-2.25; M4 2.25,-1.75; M5 2.25,-1.25; M6 2.25,-0.75; M7 2.25,-0.25; M8 2.25,0.25; M9 2.25,0.75; M10 2.25,1.25; M11 2.25,1.75; M12 2.25,2.25; M13 2.25,2.75; M14 2.25,3.25; N1 2.75,-3.25; N2 2.75,-2.75; N3 2.75,-2.25; N4 2.75,-1.75; N5 2.75,-1.25; N6 2.75,-0.75; N7 2.75,-0.25; N8 2.75,0.25; N9 2.75,0.75; N10 2.75,1.25; N11 2.75,1.75; N12 2.75,2.25; N13 2.75,2.75; N14 2.75,3.25; P1 3.25,-3.25; P2 3.25,-2.75; P3 3.25,-2.25; P4 3.25,-1.75; P5 3.25,-1.25; P6 3.25,-0.75; P7 3.25,-0.25; P8 3.25,0.25; P9 3.25,0.75; P10 3.25,1.25; P11 3.25,1.75; P12 3.25,2.25; P13 3.25,2.75; P14 3.25,3.25 | smd 0.5 x 0.5: FID1 -6.5,5.75; FID2 6.5,5.75; FID3 6.5,-5.75
USBA_HAYATO = smd 1.12 x 2.88: D+ 7.6,3.45; D- 5.55,3.45; GND 10.1,3.45; VBUS 3.05,3.45 | drill 2.3: GN3 13.15,0; GND2 0,0
AP6212 = smd 1.125 x 0.5: 1 -5.687,4.5; 2 -5.687,3.6; 3 -5.687,2.7; 4 -5.687,1.8; 5 -5.687,0.9; 6 -5.687,0; 7 -5.687,-0.9; 8 -5.687,-1.8; 9 -5.687,-2.7; 10 -5.687,-3.6; 11 -5.687,-4.5; 23 5.687,-4.5; 24 5.687,-3.6; 25 5.687,-2.7; 26 5.687,-1.8; 27 5.687,-0.9; 28 5.687,0; 29 5.687,0.9; 30 5.687,1.8; 31 5.687,2.7; 32 5.687,3.6; 33 5.687,4.5 | smd 0.5 x 1.125: 12 -4.5,-5.687; 13 -3.6,-5.687; 14 -2.7,-5.687; 15 -1.8,-5.687; 16 -0.9,-5.687; 17 0,-5.687; 18 0.9,-5.687; 19 1.8,-5.687; 20 2.7,-5.687; 21 3.6,-5.687; 22 4.5,-5.687; 34 4.5,5.687; 35 3.6,5.687; 36 2.7,5.687; 37 1.8,5.687; 38 0.9,5.687; 39 0,5.687; 40 -0.9,5.687; 41 -1.8,5.687; 42 -2.7,5.687; 43 -3.6,5.687; 44 -4.5,5.687 | smd 0.6 x 0.6: 45 -2.7,3.6; 46 -0.9,3.6; 47 0.9,3.6
TSX-3225 = smd 1.4 x 1.15: P$1 -1.1,-0.8; P$2 1.1,-0.8; P$3 1.1,0.8; P$4 -1.1,0.8
JST_PH_VERT_5P = smd 1 x 5.5: 3 -4,-2; 4 -2,-2; 5 0,-2; 6 2,-2; 7 4,-2 | smd 1.6 x 3: GND1 -6.4,0.25; GND2 6.4,0.25
TACT_SWITCH_HORIZONTAL = drill 0.7: GND 0,1; P$2 1.5,-1; P$3 -1.5,-1
JST_PH_VERT_2P = smd 1.6 x 3: GND1 -3.4,0.25; GND2 3.4,0.25 | smd 1 x 5.5: P$1 -1,-2; P$2 1,-2
FPC_HAYATO = smd 0.3 x 1.25: 1 1,1.4; 2 1.5,1.4; 3 2,1.4; 4 2.5,1.4; 5 3,1.4; 6 3.5,1.4; 7 4,1.4; 8 4.5,1.4; 9 5,1.4; 10 5.5,1.4; 11 6,1.4; 12 6.5,1.4; 13 7,1.4; 14 7.5,1.4; 15 8,1.4; 16 8.5,1.4; 17 9,1.4; 18 9.5,1.4; 19 10,1.4; 20 10.5,1.4; 21 11,1.4; 22 11.5,1.4; 23 12,1.4; 24 12.5,1.4; 25 13,1.4; 26 13.5,1.4; 27 14,1.4; 28 14.5,1.4; 29 15,1.4; 30 15.5,1.4; 31 16,1.4; 32 16.5,1.4; 33 17,1.4; 34 17.5,1.4; 35 18,1.4; 36 18.5,1.4; 37 19,1.4; 38 19.5,1.4; 39 20,1.4; 40 20.5,1.4; 41 21,1.4; 42 21.5,1.4; 43 22,1.4; 44 22.5,1.4; 45 23,1.4; 46 23.5,1.4; 47 24,1.4; 48 24.5,1.4; 49 25,1.4; 50 25.5,1.4; 51 26,1.4; 52 26.5,1.4; 53 27,1.4; 54 27.5,1.4 | smd 1.8 x 2.2: P$1 -0.9,-1.1; P$56 29.4,-1.1
ANT_ESP8206_SYM = smd 1.524 x 1.016: P$1 5.944,13.741 | smd 1.524 x 0.508: P$2 5.994,11.608
JST1.25_HOR_2P = smd 0.8 x 1.6: P$1 -0.625,0; P$2 0.625,0 | smd 2.1 x 3: P$3 -3.175,-2.9; P$4 3.175,-2.9
MICROUSB_HAYATO = smd 1 x 2: BASE@1 0.75,2.88; BASE@2 -0.75,2.88 | smd 0.4 x 1.35: D+ 0,0.105; D- 0.65,0.105; GND -1.3,0.105; ID -0.65,0.105; VBUS 1.3,0.105 | smd 2.3 x 1.2: P$1 -3.05,0; P$2 3.05,0 | drill 0.6 pad 2.5 square: SPRT@3 3.6,2.78; SPRT@4 -3.6,2.78
BATTERY_CON_3PIN = smd 1.4 x 1.6: P$1 -2.5,0; P$2 0,0; P$3 2.5,0 | smd 3.3 x 2.1: P$4 0,-3.25 | hole 0.75: -3.4,-2.8; 3.4,-2.8
SCREW_M2_04 = smd 6.2 x 6.2: P$1 0,0 | hole 3.73: 0,0
PJ342_6P = smd 1.5 x 2.3: 1 2.15,-3.45; 3 5.5,-3.45; 4 9.45,3.45; 5 11,-3.45 | smd 1.5 x 2.8: 2 2.15,3.2; 6 11.5,3.2 | hole 1.4: 9.5,0; 2.5,0
WHEEL_POT = drill 0.8: 2A -2,0; 2B 0,0; 3A 4,0; 3B 2,0; GND -4,0 | drill 1.2: GND1 -5,10.1; GND2 5,10.1
ANT_H2U262GKBA0100 = smd 1 x 2.2: NC 2.4,0; SIGNAL -2.4,0
JOYSTICK-POT = smd 1.4 x 2.3: 1 -2,-12.45; 2 0,-12.45; 3 2,-12.45 | smd 2.3 x 1.4: 1' 12.45,-2; 2' 12.45,0; 3' 12.45,2 | hole 1.5: -6,-6; 6,6
HN1X3 = drill 1 pad 1.778 square: 1 -2.54,0 | drill 1 pad 1.778: 2 0,0; 3 2.54,0
USB_TWO_LEVEL_ALINKTEK = drill 0.9: 1.1 -3.5,2.97; 1.2 -1,2.97; 1.3 1,2.97; 1.4 3.5,2.97; 2.1 -3.5,0.47; 2.2 -1,0.47; 2.3 1,0.47; 2.4 3.5,0.47 | drill 2.3: GND1 -6.7,-2.7; GND2 6.7,-2.7; GND3 6.7,3; GND4 -6.7,3
SOT-23-5 = smd 1.2 x 0.55: 1 1.3,-0.95; 2 1.3,0; 3 1.3,0.95; 4 -1.3,0.95; 5 -1.3,-0.95

## Placement (x,y rotation side)
1.2V_CPU  TESTPADTESTPAD_40-ROUND  [TESTPAD_40-ROUND]  61.92,116.37 0 bottom
1.2V_INT  TESTPADTESTPAD_40-ROUND  [TESTPAD_40-ROUND]  57.09,101.8 0 bottom
1.5V  TESTPADTESTPAD_40-ROUND  [TESTPAD_40-ROUND]  52,83 270 bottom
2.5V  TESTPADTESTPAD_40-ROUND  [TESTPAD_40-ROUND]  36.91,83.09 0 bottom
2.8V_LDO3  TESTPADTESTPAD_40-ROUND  [TESTPAD_40-ROUND]  70.94,102.93 0 bottom
2.8V_LDO4  TESTPADTESTPAD_40-ROUND  [TESTPAD_40-ROUND]  54.51,107.28 0 bottom
3.0VA  TESTPADTESTPAD_40-ROUND  [TESTPAD_40-ROUND]  58.8,109.4 0 bottom
3.3V  TESTPADTESTPAD_40-ROUND  [TESTPAD_40-ROUND]  44.9,103.6 270 bottom
5V  [1X01]  77.26,119.61 0 top
5VEXT  TESTPADTESTPAD_40-ROUND  [TESTPAD_40-ROUND]  77,111 0 bottom
+5V  TESTPADTESTPAD_40-ROUND  [TESTPAD_40-ROUND]  2.97,88.41 0 bottom
AXP2  TESTPADTESTPAD30/30  [TESTPAD_30-ROUND]  69.16,111.72 0 bottom
AXP3  TESTPADTESTPAD30/30  [TESTPAD_30-ROUND]  72.3,110.52 0 top
BACKUP  TESTPADTESTPAD30/30  [TESTPAD_30-ROUND]  65.7,98.78 0 top
BAT  TESTPADTESTPAD_40-ROUND  [TESTPAD_40-ROUND]  74.09,97.34 0 bottom
C1  100nF  [C0402_TI]  63.52,59.42 270 top
C2  4.7uF/6.3V  [C0603_DWS]  54.94,87.28 180 top
C3  220nF  [C0402_TI]  47.56,65.73 180 bottom
C4  220nF  [C0402_TI]  47.46,66.72 180 bottom
C5  220nF  [C0402_TI]  47.56,69.46 180 bottom
C6  220nF  [C0402_TI]  47.56,70.35 180 bottom
C7  Pro(10nF)  [C0402_TI]  21.16,95.96 0 top
C8  220nF  [C0402_TI]  47.56,73.25 180 bottom
C9  220nF  [C0402_TI]  67.61,59.26 90 top
C10  1uF  [C0402_TI]  16.58,63.59 90 top
C11  220nF  [C0402_TI]  47.14,74.77 90 bottom
C12  220nF  [C0402_TI]  48.09,74.77 90 bottom
C13  NC(10uF/6.3V)  [C0603_DWS]  54.94,85.75 180 top
C14  100nF  [C0402_TI]  65.08,57.9 180 top
C15  22uF/6.3V  [C0603_DWS]  57.94,98.69 180 top
C16  220nF  [C0402_TI]  47.56,71.24 0 bottom
C17  220nF  [C0402_TI]  47.56,72.23 0 bottom
C18  220nF  [C0402_TI]  42.38,70.96 270 bottom
C19  Pro(10nF)  [C0402_TI]  21.16,96.86 0 top
C20  Pro(10nF)  [C0402_TI]  21.16,95.06 0 top
C21  1uF  [C0402_TI]  68.93,86.16 180 top
C22  1uF  [C0402_TI]  71.16,76.47 270 top
C23  100nF  [C0402_TI]  62.6,86.18 180 top
C24  100nF  [C0402_TI]  60.43,86.17 180 top
C25  100nF  [C0402_TI]  66.93,86.17 180 top
C26  100nF  [C0402_TI]  71.82,64.9 180 top
C27  100nF  [C0402_TI]  58.27,86.16 0 top
C28  Pro(10nF)  [C0402_TI]  21.16,94.16 0 top
C29  NA  [C1206_5MILS_WS_ISO]  22.47,106.4 90 bottom
C30  1uF  [C0402_TI]  55.32,61.66 135 top
C31  1uF  [C0402_TI]  66.67,59.27 90 top
C32  100nF  [C0402_TI]  71.14,71.06 90 top
C33  100nF  [C0402_TI]  71.28,62.5 270 top
C34  100nF  [C0402_TI]  72.32,62.5 270 top
C35  1nF/2kV/X7R/1206  [C1206_5MILS_WS_ISO]  6.5,106.39 90 bottom
C36  27pF  [C0402_TI]  1.35,97.2 270 top
C37  220nF  [C0402_TI]  41.31,65.17 90 bottom
C38  220nF  [C0402_TI]  40.63,69.62 0 bottom
C39  220nF  [C0402_TI]  40.37,72.68 180 bottom
C40  220nF  [C0402_TI]  42.38,69.03 270 bottom
C41  220nF  [C0402_TI]  37.96,66.54 180 bottom
C42  220nF  [C0402_TI]  47.46,68.58 0 bottom
C43  220nF  [C0402_TI]  44.89,69.62 180 bottom
C44  27pF  [C0402_TI]  2.38,91.17 0 top
C45  220nF  [C0402_TI]  44.36,74.77 270 bottom
C46  220nF  [C0402_TI]  46.21,74.77 270 bottom
C47  100nF  [C0402_TI]  13.08,100.29 180 top
C48  22uF/6.3V  [C0603_DWS]  4.97,99.1 0 top
C49  22uF/6.3V  [C0603_DWS]  7.5,92.65 180 bottom
C50  10pF  [C0402_TI]  29.93,93.68 0 bottom
C51  1uF/6.3V  [C0402_TI]  47.7,6.55 180 top
C52  1uF/6.3V  [C0402_TI]  47.6,7.98 180 top
C53  22uF/6.3V  [C0603_DWS]  77.36,111.16 270 top
C54  22uF/6.3V  [C0603_DWS]  71.71,114.85 90 top
C55  10uF/6.3V  [C0603_DWS]  12.12,95.16 270 bottom
C59  1nF  [C0402_TI]  28.22,81.47 90 top
C60  100nF  [C0402_TI]  8.17,91.44 180 bottom
C61  100nF  [C0402_TI]  6.55,91.93 90 top
C62  1uF/6.3V  [C0603_DWS]  5.31,92.59 90 top
C63  100nF  [C0402_TI]  5.62,97.88 0 top
C64  100nF  [C0402_TI]  8.58,100.13 90 bottom
C65  220nF  [C0402_TI]  44.08,65.17 90 bottom
C66  220nF  [C0402_TI]  60.87,111.54 0 top
C67  220nF  [C0402_TI]  43.11,65.17 90 bottom
C68  220nF  [C0402_TI]  40.35,65.17 90 bottom
C69  220nF  [C0402_TI]  42.21,65.17 90 bottom
C70  220nF  [C0402_TI]  42.38,67.1 270 bottom
C71  4.7uF/6.3V  [C0603_DWS]  14.82,22.43 180 top
C72  100nF  [C0402_TI]  14.58,21.21 0 top
C73  NC/1pF  [C0402_TI]  9.76,22.1 270 top
C74  220nF  [C0402_TI]  43.46,74.77 90 bottom
C75  220nF  [C0402_TI]  40.75,74.77 90 bottom
C76  220nF  [C0402_TI]  42.56,74.83 90 bottom
C77  NC/1pF  [C0402_TI]  11.22,22.53 0 top
C79  4.7uF/6.3V  [C0603_DWS]  24.17,33.54 90 top
C80  100nF  [C0402_TI]  22.89,34.2 270 top
C81  4.7uF/6.3V  [C0603_DWS]  25.69,36.48 90 top
C82  100nF  [C0402_TI]  26.92,36.88 270 top
C83  18pF  [C0402_TI]  17.28,18.2 90 top
C84  18pF  [C0402_TI]  22.04,21.8 180 top
C85  Pro(100nF)  [C0402_TI]  26.59,51.27 0 top
C86  Pro(2.2uF/6.3V/10%/X5R/C0603)  [C0603_DWS]  27,52.49 180 top
C87  Pro(100nF)  [C0402_TI]  14.5,43.94 180 top
C88  Pro(2.2uF/6.3V/10%/X5R/C0603)  [C0603_DWS]  13.83,46.68 0 top
C89  Pro(100nF)  [C0402_TI]  14.51,43.03 180 top
C90  Pro(2.2uF/6.3V/10%/X5R/C0603)  [C0603_DWS]  14.12,41.82 0 top
C91  Pro(22uF/6.3V)  [C0603_DWS]  13.84,45.15 180 top
C92  220nF  [C0402_TI]  37.93,72.96 0 bottom
C93  220nF  [C0402_TI]  42.76,76.75 0 bottom
C94  220nF  [C0402_TI]  37.96,69.36 180 bottom
C95  220nF  [C0402_TI]  46.77,103.18 180 top
C96  220nF  [C0402_TI]  42.38,72.89 90 bottom
C97  220nF  [C0402_TI]  47.56,64.66 0 bottom
C98  220nF  [C0402_TI]  46.01,65.17 90 bottom
C99  220nF  [C0402_TI]  45.04,65.17 90 bottom
C100  220nF  [C0402_TI]  39.38,65.17 90 bottom
C106  220nF  [C0402_TI]  37.96,65.63 0 bottom
C107  220nF  [C0402_TI]  37.96,64.66 0 bottom
C109  100nF  [C0402_TI]  41.33,58.31 180 top
C110  10pF  [C0402_TI]  54.18,60.57 135 top
C112  4.7uF/6.3V  [C0603_DWS]  2.58,98.22 90 top
C113  100nF/6.3V  [C0402_TI]  38.3,101.43 270 top
C114  10uF/6.3V  [C0603_DWS]  37.03,100.85 270 top
C115  10pF  [C0402_TI]  53.37,57.16 90 top
C116  33pF  [C0402_TI]  31.35,69.97 90 top
C117  33pF  [C0402_TI]  25.72,69.36 270 top
C118  4.7uF/6.3V  [C0603_DWS]  49.43,59.7 90 bottom
C119  100nF  [C0402_TI]  47.46,67.61 0 bottom
C120  22uF/6.3V  [C0603_DWS]  33.41,81.32 0 top
C121  220nF  [C0402_TI]  38.11,72.05 180 bottom
C122  10uF/6.3V  [C0603_DWS]  39.64,2.22 0 top
C125  1uF  [C0402_TI]  34.49,77.97 270 bottom
C126  100nF  [C0402_TI]  33.12,76.42 180 bottom
C127  4.7uF/6.3V  [C0603_DWS]  32.18,79.4 270 bottom
C128  4.7uF/6.3V  [C0603_DWS]  33.71,80.59 270 bottom
C129  100nF  [C0402_TI]  33.57,77.98 270 bottom
C132  220nF  [C0402_TI]  35.49,81.17 270 top
C133  220nF  [C0402_TI]  36.39,81.17 270 top
C134  10uF/6.3V  [C0603_DWS]  37.59,81.74 270 top
C139  1nF  [C0402_TI]  24.14,77.8 0 top
C140  1nF  [C0402_TI]  24.13,79.59 0 top
C141  1nF  [C0402_TI]  24.14,76.9 0 top
C142  1nF  [C0402_TI]  24.13,78.7 0 top
C144  100nF  [C0402_TI]  37.96,68.47 180 bottom
C146  220pF/6.3V  [C0402_TI]  30.44,3.35 90 top
C147  220pF/6.3V  [C0402_TI]  30.46,6.46 270 top
C148  100nF  [C0402_TI]  37.96,67.51 180 bottom
C152  100nF  [C0402_TI]  36.72,106.33 270 bottom
C153  100nF/25V  [C0805_5MIL]  42.25,95.24 180 bottom
C154  10uF/25V  [C0805_5MIL]  42.84,93.21 180 bottom
C155  10uF/6.3V  [C0603_DWS]  68.81,102.41 270 bottom
C156  22uF/6.3V  [C0603_DWS]  73.26,117.36 270 top
C157  100nF/6.3V  [C0402_TI]  57.05,111.48 180 bottom
C158  10uF/6.3V  [C0603_DWS]  67.28,103.12 270 bottom
C159  1uF  [C0603_DWS]  73.74,97.22 180 top
C160  10uF/6.3V  [C0603_DWS]  74.19,101.67 90 top
C161  10uF/6.3V  [C0603_DWS]  73.44,94.82 270 top
C162  10uF/6.3V  [C0603_DWS]  68.46,106.72 0 bottom
C163  10uF/6.3V  [C0603_DWS]  65.76,103.12 270 bottom
C164  220nF  [C0402_TI]  41.66,74.83 90 bottom
C166  10uF/6.3V  [C0603_DWS]  61.36,109.97 180 top
C167  1nF  [C0402_TI]  62.06,113.99 90 top
C170  10uF/6.3V  [C0603_DWS]  67.66,112.4 90 top
C172  10uF/6.3V  [C0603_DWS]  57.95,101.77 0 top
C173  1nF  [C0402_TI]  55.06,101.94 180 top
C174  10uF/6.3V  [C0603_DWS]  60.88,109.22 90 bottom
C176  1uF  [C0402_TI]  63.03,102.54 270 bottom
C177  22uF/6.3V  [C0603_DWS]  34.15,83.77 0 top
C178  220nF  [C0402_TI]  37.96,71.15 180 bottom
C179  10uF/6.3V  [C0603_DWS]  64.25,103.11 90 bottom
C180  1uF  [C0402_TI]  63.55,99.7 90 top
C181  22uF/6.3V  [C0603_DWS]  57.95,100.22 180 top
C182  10uF/6.3V  [C0603_DWS]  61.1,101.54 90 bottom
C183  10uF/6.3V  [C0603_DWS]  57.28,106.71 0 bottom
C184  220nF  [C0402_TI]  37.96,70.25 180 bottom
C185  10uF/6.3V  [C0603_DWS]  73.17,104.38 0 top
C186  10uF/6.3V  [C0603_DWS]  71.79,102.62 0 top
C187  1nF  [C0402_TI]  69.78,108.83 270 top
C188  10uF/6.3V  [C0603_DWS]  54.36,106.71 270 top
C189  220nF  [C0402_TI]  37.43,74.59 270 bottom
C191  22uF/6.3V  [C0603_DWS]  33.9,92.14 0 top
C192  22uF/6.3V  [C0603_DWS]  34.26,85.3 180 top
C193  100nF  [C0402_TI]  34.47,86.51 180 top
C196  100nF  [C0402_TI]  38.33,74.59 270 bottom
C198  4.7uF/6.3V  [C0603_DWS]  39.54,74.91 90 bottom
C201  22pF  [C0402_TI]  47.18,82.18 180 top
C202  22uF/6.3V  [C0603_DWS]  46.38,87.99 0 top
C203  22uF/6.3V  [C0603_DWS]  51.67,85.75 180 top
C204  22uF/6.3V  [C0603_DWS]  51.66,87.29 180 top
C205  22uF/6.3V  [C0603_DWS]  68.36,121.8 180 top
C206  22uF/6.3V  [C0603_DWS]  68.35,120.27 180 top
C207  22uF/6.3V  [C0603_DWS]  80.22,12.99 270 top
C208  22uF/6.3V  [C0603_DWS]  61.06,121.44 270 top
C209  1nF  [C0402_TI]  27.31,81.47 90 top
C210  22uF/6.3V  [C0603_DWS]  51.99,96 180 top
C211  22pF  [C0402_TI]  49.68,102.65 0 top
C212  22uF/6.3V  [C0603_DWS]  47.06,100.45 0 top
C213  22uF/6.3V  [C0603_DWS]  47.06,101.97 0 top
CN1  Pro(1X4FPC0.5)  [FPC_0.5MM-4]  53.6,14 225 top
CN2  Pro(1X4FPC0.5)  [FPC_0.5MM-4]  24.5,74.1 90 bottom
D1  1N5819(S4SOD-123)  [SOD-123]  65.12,89.37 0 top
D2  1N5819(S4SOD-123)  [SOD-123]  75.43,60.9 270 top
D5  1N5822/SS34/SMA  [MELF-MLL41]  68.99,117.99 180 top
D6  SS14  [DO214AC]  40.22,95.48 0 top
DOWN  PAD_BUTTON  [PAD_BUTTON]  67,31.5 270 bottom
DS  TESTPADTESTPAD_40-ROUND  [TESTPAD_40-ROUND]  23.14,45.85 0 bottom
FB1-A  BLM21PG220SH1D (Ferrite)  [_0805]  33.1,5.95 180 top
FB2-A  BLM21PG220SH1D (Ferrite)  [_0805]  33.1,3.94 180 top
FMINL  TESTPADTESTPAD_40-ROUND  [TESTPAD_40-ROUND]  17.75,95.7 0 bottom
FMINR  TESTPADTESTPAD_40-ROUND  [TESTPAD_40-ROUND]  17.75,93.9 0 bottom
FUSE1  FSMD035  [1206]  9.53,87.92 180 bottom
GND  TESTPADTESTPAD_40-ROUND  [TESTPAD_40-ROUND]  77,112.5 0 bottom
HDMI  HDMI-SWM-19  [HDMI-SWM-19]  5.67,78.72 90 top
IPSOUT  TESTPADTESTPAD_40-ROUND  [TESTPAD_40-ROUND]  59.38,104.27 0 bottom
J1  Pro(1-2199230-5-LITE)  [CONN67_2199230_LITE]  31.22,103.17 90 top
K1  PAD_BUTTON  [PAD_BUTTON]  23,51 45 bottom
K2  PAD_BUTTON  [PAD_BUTTON]  9.9,39.9 0 bottom
K3  PAD_BUTTON  [PAD_BUTTON]  37,40.5 0 bottom
K4  PAD_BUTTON  [PAD_BUTTON]  23.5,29.4 0 bottom
L1  22uH/CD32  [CD32_INDUCTOR]  40.37,98.57 270 top
L2  FB0805/600R/2A  [L0805_5MIL_DWS]  68.92,115.26 0 top
L3  FB0805/600R/2A  [L0805_5MIL_DWS]  46.26,110.47 180 bottom
L4  3.3uH/0.7A/CD25/maxHeight 2mm _NRS3015T3R3MNGHV  [CD25]  28.55,33.25 270 top
L5  FB0805/600R/2A  [L0805_5MIL_DWS]  4.57,100.88 180 top
L11  2.2uH/1.5A/DCR<0.1R/CD32  [CD32]  73.14,107.32 270 top
L12  2.2uH/1.5A/DCR<0.1R/CD32  [CD32]  64.72,112.64 180 top
L13  2.2uH/1.5A/DCR<0.1R/CD32  [CD32]  57.15,105.28 270 top
L14  2.2uH/1.5A/DCR<0.1R/CD32  [CD32]  49,90.8 0 top
L15  2.2uH/1.5A/DCR<0.1R/CD32  [CD32]  63.32,117.27 0 top
L16  2.2uH/1.5A/DCR<0.1R/CD32  [CD32]  47.44,97.4 90 top
L17  Pro(FB0805/600R/2A)  [L0805_5MIL_DWS]  14.37,49.47 270 top
LAN1  RJLBC-060TC1  [RJLBC-060TC1_MILLING]  14.5,113.2 180 top
LED1  BLUE  [CHIPLED_0805_NOOUTLINE]  81.3,105.2 90 bottom
LED2  BLUE  [CHIPLED_0805_NOOUTLINE]  81.3,109.6 270 bottom
LED3  BLUE  [CHIPLED_0805_NOOUTLINE]  81.3,100.8 90 bottom
LED+  TESTPADTESTPAD_40-ROUND  [TESTPAD_40-ROUND]  50.79,91.23 0 bottom
LED-  TESTPADTESTPAD_40-ROUND  [TESTPAD_40-ROUND]  50.76,92.76 0 bottom
LEFT  PAD_BUTTON  [PAD_BUTTON]  75,39.8 180 bottom
LINEINL  TESTPADTESTPAD_40-ROUND  [TESTPAD_40-ROUND]  19.75,95.7 0 bottom
LINEINR  TESTPADTESTPAD_40-ROUND  [TESTPAD_40-ROUND]  19.75,93.9 0 bottom
LRADC0  TESTPADTESTPAD_40-ROUND  [TESTPAD_40-ROUND]  80,28.5 0 bottom
LRADC1  TESTPADTESTPAD_40-ROUND  [TESTPAD_40-ROUND]  80,30 0 bottom
MIC1OUTN  TESTPADTESTPAD_40-ROUND  [TESTPAD_40-ROUND]  28.93,79.69 0 top
MIC1OUTP  TESTPADTESTPAD_40-ROUND  [TESTPAD_40-ROUND]  30.17,79.91 0 top
MICIN1  TESTPADTESTPAD_40-ROUND  [TESTPAD_40-ROUND]  31.06,81.34 0 top
MICIN2  TESTPADTESTPAD_40-ROUND  [TESTPAD_40-ROUND]  29.54,81.3 0 top
PB12  TESTPADTESTPAD_40-ROUND  [TESTPAD_40-ROUND]  18.47,36.06 0 bottom
PC0  TESTPADTESTPAD_40-ROUND  [TESTPAD_40-ROUND]  27.63,64.82 0 top
PC1  TESTPADTESTPAD_40-ROUND  [TESTPAD_40-ROUND]  28.41,65.73 0 top
PC2  TESTPADTESTPAD_40-ROUND  [TESTPAD_40-ROUND]  28.2,63.07 0 top
PC3  TESTPADTESTPAD_40-ROUND  [TESTPAD_40-ROUND]  29.51,65.73 0 bottom
PC4  TESTPADTESTPAD_40-ROUND  [TESTPAD_40-ROUND]  29.12,63.96 0 top
PC5  TESTPADTESTPAD_40-ROUND  [TESTPAD_40-ROUND]  30.03,64.87 0 top
PC17  TESTPADTESTPAD_40-ROUND  [TESTPAD_40-ROUND]  29.44,61.34 0 bottom
PC19  TESTPADTESTPAD_40-ROUND  [TESTPAD_40-ROUND]  26.95,69.85 0 bottom
PC20  TESTPADTESTPAD_40-ROUND  [TESTPAD_40-ROUND]  28.21,69.84 0 bottom
PC21  TESTPADTESTPAD_40-ROUND  [TESTPAD_40-ROUND]  30.4,66.76 0 bottom
PC22  TESTPADTESTPAD_40-ROUND  [TESTPAD_40-ROUND]  29.2,66.95 0 bottom
PC23  TESTPADTESTPAD_40-ROUND  [TESTPAD_40-ROUND]  27.57,62.41 0 bottom
PG0  TESTPADTESTPAD_40-ROUND  [TESTPAD_40-ROUND]  34.27,64.35 0 bottom
PG1  TESTPADTESTPAD_40-ROUND  [TESTPAD_40-ROUND]  33.25,62.64 0 bottom
PG2  TESTPADTESTPAD_40-ROUND  [TESTPAD_40-ROUND]  33.26,59.84 0 bottom
PG3  TESTPADTESTPAD_40-ROUND  [TESTPAD_40-ROUND]  33.8,58.79 0 bottom
PG4  TESTPADTESTPAD_40-ROUND  [TESTPAD_40-ROUND]  35.13,59.98 0 bottom
PG5  TESTPADTESTPAD_40-ROUND  [TESTPAD_40-ROUND]  34.36,57.72 0 bottom
PG6  TESTPADTESTPAD_40-ROUND  [TESTPAD_40-ROUND]  34.12,61.07 0 bottom
PG7  TESTPADTESTPAD_40-ROUND  [TESTPAD_40-ROUND]  35.24,58.83 0 bottom
PG8  TESTPADTESTPAD_40-ROUND  [TESTPAD_40-ROUND]  35.64,57.71 0 bottom
PG9  TESTPADTESTPAD_40-ROUND  [TESTPAD_40-ROUND]  36.42,61.28 0 bottom
PG10  TESTPADTESTPAD_40-ROUND  [TESTPAD_40-ROUND]  37.11,57.71 0 bottom
PG24  TESTPADTESTPAD_40-ROUND  [TESTPAD_40-ROUND]  33.17,63.84 0 bottom
PH2  TESTPADTESTPAD30/30  [TESTPAD_30-ROUND]  47.36,61.21 0 bottom
PH5  TESTPADTESTPAD30/30  [TESTPAD_30-ROUND]  47.63,60.05 0 bottom
PH6  TESTPADTESTPAD_40-ROUND  [TESTPAD_40-ROUND]  51.05,56.77 0 bottom
PH8  TESTPADTESTPAD_40-ROUND  [TESTPAD_40-ROUND]  50.94,58.32 0 bottom
PH17  TESTPADTESTPAD_40-ROUND  [TESTPAD_40-ROUND]  55.27,56.1 0 bottom
PH18  TESTPADTESTPAD_40-ROUND  [TESTPAD_40-ROUND]  53.15,58.27 0 bottom
PH19  TESTPADTESTPAD_40-ROUND  [TESTPAD_40-ROUND]  54.4,57.43 0 bottom
PH21  TESTPADTESTPAD_40-ROUND  [TESTPAD_40-ROUND]  51.14,60.26 0 bottom
PH22  TESTPADTESTPAD_40-ROUND  [TESTPAD_40-ROUND]  53.14,55.86 0 bottom
PI10  TESTPADTESTPAD_40-ROUND  [TESTPAD_40-ROUND]  37.57,58.79 0 bottom
PI11  TESTPADTESTPAD_40-ROUND  [TESTPAD_40-ROUND]  38.35,57.7 0 bottom
PI12  TESTPADTESTPAD_40-ROUND  [TESTPAD_40-ROUND]  39.55,57.69 0 bottom
PI13  TESTPADTESTPAD_40-ROUND  [TESTPAD_40-ROUND]  40.81,59.32 0 bottom
PI16  TESTPADTESTPAD_40-ROUND  [TESTPAD_40-ROUND]  37.36,59.91 0 bottom
PI19  TESTPADTESTPAD_40-ROUND  [TESTPAD_40-ROUND]  41.42,60.95 0 bottom
PI20  TESTPADTESTPAD_40-ROUND  [TESTPAD_40-ROUND]  40.23,60.89 0 bottom
Q2  32768Hz/6pF  [MC-306]  58.19,56.79 0 top
R1  2k/1%  [R0402_TI]  65.1,59.85 0 top
R2  47k  [R0402_TI]  22.13,67.74 0 bottom
R3  47k  [R0402_TI]  21.92,68.64 0 bottom
R4  2k/1%  [R0402_TI]  65.08,58.83 180 top
R5  47k  [R0402_TI]  21.92,69.55 0 bottom
R6  47k  [R0402_TI]  24.33,66.31 270 bottom
R7  240R/1%  [R0402_TI]  64.77,86.17 0 top
R8  240R/1%  [R0402_TI]  71.81,63.96 180 top
R9  24R  [R0402_TI]  53.74,74.23 180 top
R10  24R  [R0402_TI]  53.73,75.45 180 top
R11  22R  [R0402_TI]  18.06,64.37 45 top
R12  10k  [R0402_TI]  9.97,89.46 270 top
R13  47k  [R0402_TI]  22.9,66.83 0 bottom
R14  240R/1%  [R0402_TI]  49.35,79.33 315 bottom
R15  10k  [R0402_TI]  5.3,90.5 180 top
R16  10k  [R0402_TI]  5.65,89.57 180 top
R17  10k  [R0402_TI]  7.13,89.11 270 top
R18  1.5k  [R0402_TI]  20.56,82.81 270 bottom
R19  1.5k  [R0402_TI]  18.74,83.52 270 bottom
R20  1.5k  [R0402_TI]  9.07,89.46 90 top
R21  1.5k  [R0402_TI]  8.17,89.46 90 top
R22  1k/1%  [R0402_TI]  38.18,104.74 0 top
R23  10k/5%  [R0402_TI]  40.13,104.74 180 top
R24  33R  [R0402_TI]  31.95,93.47 180 bottom
R25  0R(Board_Mounted)  [R0402_TI_0R]  16.2,37.4 0 top
R26  30K/1%  [R0402_TI]  50.14,6.96 180 top
R27  NC  [R0402_TI]  67.84,109.31 270 bottom
R28  1k/1%  [R0402_TI]  45.31,96.21 90 bottom
R29  12R/1%  [R0603_5MIL_DWS]  46.49,94.48 180 bottom
R30  47k  [R0402_TI]  41.34,59.42 0 top
R31  100R/1%  [R0402_TI]  45.34,6.45 180 top
R32  22R/1%  [R0402_TI]  22.8,29.64 270 top
R33  100R/1%  [R0402_TI]  45.25,7.96 180 top
R34  2k  [R0402_TI]  23.41,35.71 0 top
R35  10M  [R0402_TI]  58.09,53.13 180 top
R36  100R  [R0402_TI]  17.27,20.18 270 top
R37  470R  [R0402_TI]  20.94,12.42 0 top
R38  560K  [R0402_TI]  22.78,14.76 270 top
R39  NC  [R0402_TI]  18.96,22.12 90 top
R40  NC  [R0402_TI]  20.29,22.11 90 top
R41  47k  [R0402_TI]  14.86,68.53 0 bottom
R42  NA(2.2k)  [R0603_5MIL_DWS]  65.8,55.07 90 top
R43  200k/1%  [R0402_TI]  32.15,77.31 0 bottom
R44  NA(2.2k)  [R0603_5MIL_DWS]  67.36,55.08 270 top
R45  2k/1%  [R0402_TI]  7.19,87.69 180 top
R46  2k/1%  [R0402_TI]  9.16,87.67 180 top
R47  47k  [R0402_TI]  13.8,82.03 270 bottom
R48  NA(0R)  [R0402_TI]  45.26,74.78 90 bottom
R49  12R/1%  [R0603_5MIL_DWS]  46.49,92.95 180 bottom
R50  10k/5%  [R0402_TI]  51.02,52.51 90 bottom
R51  12.1k/1%  [R0402_TI]  6.37,98.61 180 bottom
R52  330R/1%  [R0603_5MIL_DWS]  3.53,114.47 270 top
R53  330R/1%  [R0603_5MIL_DWS]  1.84,114.46 270 top
R54  NA  [R0402_TI]  12.17,92.53 90 bottom
R55  49.9R/1%  [R0402_TI]  10.32,100.22 90 top
R56  10k/5%  [R0402_TI]  50.11,52.51 90 bottom
R57  10k/5%  [R0402_TI]  51.93,50.56 270 bottom
R58  49.9R/1%  [R0402_TI]  11.58,100.22 90 top
R59  49.9R/1%  [R0402_TI]  8.17,100.22 90 top
R60  10k/5%  [R0402_TI]  51.93,52.51 90 bottom
R61  10k/5%  [R0402_TI]  51.02,50.56 270 bottom
R62  49.9R/1%  [R0402_TI]  9.42,100.22 90 top
R63  10k  [R0402_TI]  11.24,92.53 90 bottom
R64  10k  [R0402_TI]  74.51,56.99 270 top
R65  NC  [R0402_TI]  65.71,108.6 180 bottom
R66  0.03R/1%  [R1206_5MIL_WS]  73.05,99.02 180 top
R67  NC  [R0402_TI]  81.42,13.41 90 top
R68  10k/5%  [R0402_TI]  50.11,50.56 270 bottom
R70  10k/5%  [R0402_TI]  80.93,111.21 180 bottom
R71  10k/5%  [R0402_TI]  48.29,50.56 270 bottom
R72  192R/1%  [R0402_TI]  33.61,75.51 180 bottom
R73  10k/5%  [R0402_TI]  47.37,50.56 270 bottom
R74  200k/1%  [R0402_TI]  62.65,99.7 90 top
R75  2.2k  [R0402_TI]  70.68,108.83 270 top
R76  0R  [R0402_TI]  11.23,21.61 180 top
R77  2.2k  [R0402_TI]  69.83,112.47 180 top
R78  0R  [R0402_TI]  1.6,25.25 90 top
R79  2.2k  [R0402_TI]  69.66,111.05 90 top
R80  2.2k  [R0402_TI]  64.45,99.7 270 top
R81  2.2k  [R0402_TI]  70.81,111.05 90 top
R82  10k/5%  [R0402_TI]  78.14,105.2 180 bottom
R83  0R(Board_Mounted)  [0603_0R]  32.63,83.81 270 bottom
R84  47k  [R0402_TI]  23.7,28 180 top
R85  8.25k/1%  [R0402_TI]  67.8,123.02 0 top
R86  5k/1%  [R0402_TI]  47.18,83.1 180 top
R87  100k/1%  [R0402_TI]  27.01,79.14 0 top
R88  NC  [R0402_TI]  11.66,20.14 315 top
R89  1.1k/1%  [R0402_TI]  63.48,123 180 top
R90  4k/1%  [R0402_TI]  45.74,82.72 270 top
R91  5k/1%  [R0402_TI]  49.67,101.74 0 top
R92  1.1k/1%  [R0402_TI]  51.12,100.83 180 top
R93  10k  [R0402_TI]  5.51,96.96 180 top
R94  NA  [R0402_TI]  13.09,92.53 90 bottom
R95  10k  [R0402_TI]  19.65,83.52 270 bottom
R96  NC(10k)  [R0402_TI]  23.7,26.2 180 top
R97  10k/5%  [R0402_TI]  47.37,52.51 90 bottom
R98  10k/5%  [R0402_TI]  49.2,52.51 90 bottom
R99  10k/5%  [R0402_TI]  79.79,97.21 0 bottom
R100  NC(10k)  [R0402_TI]  23.7,27.1 180 top
R101  10k/5%  [R0402_TI]  79.8,98.12 0 bottom
R102  10k/5%  [R0402_TI]  79.78,96.3 0 bottom
R103  47k  [R0402_TI]  38.8,47.2 90 top
R104  100k/1%  [R0402_TI]  27.02,80.05 0 top
R105  47k  [R0402_TI]  37.8,47.2 90 top
R106  47k  [R0402_TI]  40.8,47.2 90 top
R107  47k  [R0402_TI]  39.8,47.2 90 top
R108  0R(Board_Mounted)  [R0402_TI_0R]  50.91,16.67 135 top
R109  0R(Board_Mounted)  [R0402_TI_0R]  83.37,75.48 90 top
R110  10k/5%  [R0402_TI]  77.38,100.78 180 bottom
R111  10k/5%  [R0402_TI]  79.78,95.38 0 bottom
R112  11.8k/1%  [R0402_TI]  78.8,117.34 270 top
R113  47k  [R0402_TI]  63.61,90.99 180 top
R114  NC  [R0402_TI]  83.28,64.57 90 top
R115  10k/5%  [R0402_TI]  25.8,66.82 180 bottom
R116  10k/5%  [R0402_TI]  31.29,46.62 270 top
R117  Pro(22R)  [R0402_TI]  28.04,58.68 270 top
R118  Pro(10k)  [R0402_TI]  14.68,40.48 0 top
R119  Pro(10k)  [R0402_TI]  16.7,51.53 0 top
R120  10k/5%  [R0402_TI]  49.2,50.56 270 bottom
R121  Pro(10k)  [R0402_TI]  16.71,52.54 0 top
R133  10k/5%  [R0402_TI]  48.29,52.51 90 bottom
R154  NC  [R0402_TI]  42.77,3.32 0 top
RIGHT  PAD_BUTTON  [PAD_BUTTON]  58.4,39.8 180 bottom
SD/MMC  TFC-WPAPR-08  [TFC-WPAPR-08]  7.25,61.5 180 top
SELECT  PAD_BUTTON  [PAD_BUTTON]  54.5,12.5 270 bottom
SELECT3  PAD_BUTTON  [PAD_BUTTON]  9.7,54.7 0 bottom
SELECT4  PAD_BUTTON  [PAD_BUTTON]  37,27 0 bottom
START  PAD_BUTTON  [PAD_BUTTON]  39.6,12.5 270 bottom
SV1  [MA03-1]  73.6,6.35 180 top
SV2  [MA05-2]  30.27,19.22 0 top
SV6  [MA12-2]  60,24 0 top
TP5  TESTPADTESTPAD_40-ROUND  [TESTPAD_40-ROUND]  73.6,79.3 0 bottom
TP6  TESTPADTESTPAD_40-ROUND  [TESTPAD_40-ROUND]  73.6,81.3 0 bottom
TP11  TESTPADTESTPAD_40-ROUND  [TESTPAD_40-ROUND]  66,117 0 bottom
TP15  TESTPADTESTPAD_40-ROUND  [TESTPAD_40-ROUND]  36,2.5 270 bottom
TP16  TESTPADTESTPAD_40-ROUND  [TESTPAD_40-ROUND]  36,4.5 270 bottom
TVOUT0  TESTPADTESTPAD_40-ROUND  [TESTPAD_40-ROUND]  38.64,80.31 0 bottom
TVOUT1  TESTPADTESTPAD30/30  [TESTPAD_30-ROUND]  38.94,78.85 0 bottom
TVOUT2  TESTPADTESTPAD_40-ROUND  [TESTPAD_40-ROUND]  38.39,82.44 0 bottom
TVOUT3  TESTPADTESTPAD_40-ROUND  [TESTPAD_40-ROUND]  37.94,81.27 0 bottom
TVOUT4  TESTPADTESTPAD30/30  [TESTPAD_30-ROUND]  37.88,79.22 0 bottom
TVOUT5  TESTPADTESTPAD30/30  [TESTPAD_30-ROUND]  37.9,78.32 0 bottom
TVOUT6  TESTPADTESTPAD30/30  [TESTPAD_30-ROUND]  38.8,77.74 0 bottom
TVOUT7  TESTPADTESTPAD30/30  [TESTPAD_30-ROUND]  38.91,76.82 0 bottom
U1  A20  [TFBGA441]  42.75,69.97 90 top
U1-A  PAM8302AASCR  [MSOP8_0.65MM]  40.2,6.13 90 top
U2  K4B4G1646D-BCK0  [FBGA96_SK]  62.99,80.01 0 top
U3  K4B4G1646D-BCK0  [FBGA96_SK]  62.99,66.04 0 top
U4  SY6280AAC(SOT23-5)  [SOT23-5]  75.97,116.46 270 top
U5  AT24C16C-SSHM-T(SOIC-8)  [SO-08MN]  71.04,56.18 180 top
U7  NA(RCLAMP0524P)  [SLP2510P8]  13.55,75.8 90 top
U8  NA(RCLAMP0524P)  [SLP2510P8]  13.55,78.85 90 top
U9  NA(RCLAMP0524P)  [SLP2510P8]  13.55,81.77 90 top
U10  LAN8710A-EZC(QFN-32)  [QFN-32(DRILLS)]  9.89,95.46 270 top
U13  AXP209(QFN48)  [QFN48]  65.83,105.16 180 top
U14  KA2707  [SOT23-6]  40.64,102.6 90 top
U15  SY8009AAAC(SOT23-5)  [SOT23-5]  47.23,85.41 0 top
U16  SY7208(SOT23-6)  [SOT23-6']  63.99,120.93 0 top
U17  SY8009AAAC(SOT23-5)  [SOT23-5]  52.52,98.42 180 top
U23  Pro(KLMAG2GEND-B031(FBGA153))  [FBGA153]  23.3,44.4 180 top
U$1  USB_HAYATO  [USBA_HAYATO]  59.6,114 180 top
U$2  AP6210  [AP6212]  15.31,29.85 90 top
U$3  26MHZ_12pF  [TSX-3225]  20.03,18.9 0 top
U$4  JST_PH_VERT_5P  [JST_PH_VERT_5P]  78.76,98.2 90 top
U$5  TACT_SWITCH_HORIZONTAL  [TACT_SWITCH_HORIZONTAL]  73,122 0 top
U$6  NC(JST_PH_VERT_2P)  [JST_PH_VERT_2P]  77.84,31.86 270 top
U$7  FPC_HAYATO  [FPC_HAYATO]  47.02,89.82 0 bottom
U$8  ESP8089_ANTSYM  [ANT_ESP8206_SYM]  16.85,3.96 45 top
U$9  [PB]  25.61,10.15 0 top
U$10  [ESD_SYMBOL]  27.35,25.44 0 top
U$11  [RECYCLE_BIN1/8]  38.27,10.24 0 top
U$12  [ROHS]  52.5,3.25 0 top
U$14  [8BCRAFTLOGO]  34.87,36.98 0 top
U$15  JST2_HAYATO1.25_HOR_2PIN  [JST1.25_HOR_2P]  31.58,3.61 135 bottom
U$17  MICROUSB_HAYATO  [MICROUSB_HAYATO]  79.4,111 270 top
U$18  BC-75-3PD700(750-800)  [BATTERY_CON_3PIN]  77.6,13 270 top
U$20  SCREW_M2_04  [SCREW_M2_04]  69.2,93.9 0 top
U$21  24MHz/20ppm/20pF  [TSX-3225]  28.6,69.4 180 top
U$23  25MHZ/20pF/20ppm  [TSX-3225]  2.47,93.97 270 top
U$24  PJ342_5PIN  [PJ342_6P]  84.05,71 180 top
U$27  WHEEL_POT  [WHEEL_POT]  72,83.3 270 top
U$29  NL27WZU04  [SOT23-6]  19.94,14.78 90 top
U$30  ANT_H2U262GKBA0100  [ANT_H2U262GKBA0100]  1.61,30.98 90 top
U$31  TACT_SWITCH_HORIZONTAL  [TACT_SWITCH_HORIZONTAL]  2,105 90 top
U$32  TACT_SWITCH_HORIZONTAL  [TACT_SWITCH_HORIZONTAL]  2,110 90 top
U$33  JOYSTICK-POT  [JOYSTICK-POT]  73.5,13.7 0 bottom
UART0  HN1X3  [HN1X3]  78.91,48.46 90 top
UBOOT  TESTPADTESTPAD_40-ROUND  [TESTPAD_40-ROUND]  44.72,78.98 0 bottom
UP  PAD_BUTTON  [PAD_BUTTON]  67,48.5 90 bottom
USB2  USB_TWO_LEVELALINKTEK  [USB_TWO_LEVEL_ALINKTEK]  34.5,111.4 180 top
VDD_RTC  TESTPADTESTPAD_40-ROUND  [TESTPAD_40-ROUND]  49.4,56.74 0 bottom
VMIC  TESTPADTESTPAD_40-ROUND  [TESTPAD_40-ROUND]  31.44,79.52 0 top
VR1  AP2121AK-2.5TRE1(SOT23-5)  [SOT-23-5]  33.79,89.12 90 top
VRAM  [1X01]  57.38,88.87 0 top

## Tracks (layer width: path | path; a pad name or v marks a point on that pad's centre or on a via)
5VEXT  (via drill 0.3, 0.5)
  Top 0.203: U13.32 66.43,101.19 66.64,101.19 66.83,101.19 U13.33
  Top 0.406: U$17.VBUS 78.17,109.7 78.11,109.76
  Top 0.61: v66.9,100.46 66.64,100.71 66.64,101.19
  Top 0.8: 77.21,109.7 76.82,109.31 v77.41,109.12 77.35,109.12 v76.6,109.17
  Top 0.813: 78.11,109.76 77.87,109.76 77.21,109.7 C53.2
  Top 1.016: v66.9,100.46 66.9,99.47 v66.91,99.46
  PWR 0.2: v76.84,105.97 77.25,105.97 77.4,105.82
  PWR 0.8: v76.6,109.17 76.9,108.33 77.36,109.2
  PWR 1.016: v66.91,99.46 66.91,100.43 v66.89,100.45
  PWR 1.8: v66.91,99.46 66.91,99.2 67.3,98.81 69.12,98.81 70.02,99.71 75.44,99.71 77.4,101.67 77.4,105.82 v77.4,109.11 v77.41,109.12
  Bottom 0.2: v77.41,109.12 v77.42,109.13 77.32,109.13 76.87,109.58 | R82.1 77.61,105.2 v76.84,105.97
  Bottom 0.406: 5VEXT.1 77,109.87 v76.6,109.17
  Bottom 0.6: C158.2 v66.9,100.46
+5V  (via drill 0.5, 0.6)
  Top 0.127: R45.2 6.68,87.21 6.85,87.04 8.39,87.04 8.65,87.3 R46.2
  Top 0.2: v5.32,87.63 4.48,87.49 R45.2
  Top 0.61: 69.5,122.47 R85.2
  Top 1: 76.38,117.76 U4.4
  Top 1.016: v4.45,87.9 v5.32,87.63 | D5.1 71.23,117.83 v69.45,118.81 69.45,121.82 69.5,122.47 C206.1 C205.1 | 76.6,118.28 76.38,118.06 76.38,117.76
  Top 1.27: D5.1 71.34,118.21 71.58,118.27 | 71.58,118.27 73.14,118.25 C156.1 74.29,118.25 U4.5 76.38,117.76 | v69.45,118.81 71.58,118.27 | 71.58,118.27 v69.74,117.81
  Top 1.676: 5V.1 76.6,118.95 76.6,118.28
  PWR 0.813: 1.26,102.81 1.21,102.83 1.63,103.64 2.27,104.65 2.28,105.41 1.48,106.42 1.51,108.57 2.22,109.53 2.18,110.57 1.56,111.38 1.5,112.1 2,112.9
  PWR 1.8: v69.74,117.81 68.97,118.95 67.98,119.57 65.73,119.58 65.03,120.6 62.55,120.61 61.46,121.7 6.33,121.7 | 6.67,122.04 6.33,121.7 | 6.33,121.7 2,117.37 2,112.9 | v4.45,87.9 5.19,88 3.04,88.35 2.23,89.16 2.23,101.62 1.26,102.81
  Bottom 0.254: FUSE1.1 7.76,88.37
  Bottom 0.4: +5V.1 4.28,87.73
  Bottom 1.016: v5.32,87.63 v4.45,87.9 4.28,87.73
  Bottom 1.524: v4.45,87.9 FUSE1.1
+5V_OTG_PWR  (via drill 0.4)
  Top 0.203: U13.31 66.03,101.5 65.92,101.32
  Top 0.508: v65.84,100.55 v65.84,101.16 65.92,101.32
  Bottom 0.406: 65.83,100.46 v65.84,100.55
  Bottom 0.61: v65.84,100.55 v65.84,101.16 65.83,101.22
  Bottom 0.813: 65.83,101.22 C163.2
+5V_USB  (via drill 0.5)
  Top 0.8: L2.1 67.27,115.2 v66.43,115.29
  Top 1.27: v56.55,112.26 U$1.VBUS
  PWR 1.27: v66.43,115.29 66.21,115.32 62.09,117.25 56.58,117.24 | 56.58,117.24 38.86,117.24 38,116.38 USB2.2.1 USB2.1.1 | 56.58,117.24 56.55,117.21 v56.55,112.26
  Bottom 0.4: C157.1 56.55,112.13 v56.55,112.26
  Bottom 0.406: TP11.1 66,115.72 v66.43,115.29
  Bottom 0.61: C152.1 36.91,107.03 37.17,107.03
  Bottom 1.016: 37.17,107.03 38,107.86 USB2.1.1 USB2.2.1
+24V  (via drill 0.4, 0.5, 0.6)
  Top 0.127: 74.97,95.48 74.98,95.48 v75.03,95.08
  Top 0.203: U13.38 69.59,103.36 69.59,103.56 69.59,103.76 U13.39 | v70.75,104.71 70.53,104.65 70.22,104.96 U13.42
  Top 0.406: 74.97,95.48 74.38,95.78 | U$6.P$1 76.01,32.86 v79.1,32.9
  Top 0.6: v69.84,102.76 69.84,101.71 70.12,101.43 70.12,100.72 71.58,99.25 R66.2
  Top 0.61: 69.59,103.56 v69.84,103.3 v69.84,102.76
  Top 0.813: v80.12,11.15 80.12,11.93 | 80.12,11.93 v80.78,10.76 | 80.12,11.93 79.59,11.53 79.09,10.63 C207.2
  Top 1: R66.2 71.75,99.02 72.49,97.77 C159.2 72.95,97.12 C161.1 73.74,95.71 74.38,95.78 v74.83,95.94
  Top 1.016: C207.2 79.86,12.1 77.88,10.38 77.44,10.38 U$18.P$3 | 79.59,11.53 78.69,10.29 79.84,11.24
  Top 1.27: v74.94,94.18 74.97,95.48 | v80.12,11.15 v80.12,10.37 79.72,9.97 v79.52,9.87 79.43,9.98 v79.23,10.67
  PWR 0.406: v79.1,32.9 78.84,33.09 79.11,32.82
  PWR 0.508: v69.84,102.76 69.84,103.33
  PWR 1.016: 79.11,10.55 79.21,10.55 v79.23,10.67 78.89,11.31 78.87,11.31 77.77,12.32 77.74,12.35 73.58,12.35 72.28,11.05 72.28,9.18 73.6,7.86 SV1.2
  PWR 1.422: v74.83,95.94 75,95.69
  PWR 1.8: 75,95.69 74.45,95.61 75.01,94.65 77.39,92.27 77.39,75.21 79.42,73.18 79.42,60.13 79.42,59.9
  PWR 2.54: 78.48,58.76 78.48,59.19 79.42,60.13